# Altium project Jetson_Xavier_NX_Carrier_Board_v1.1.PrjPcb
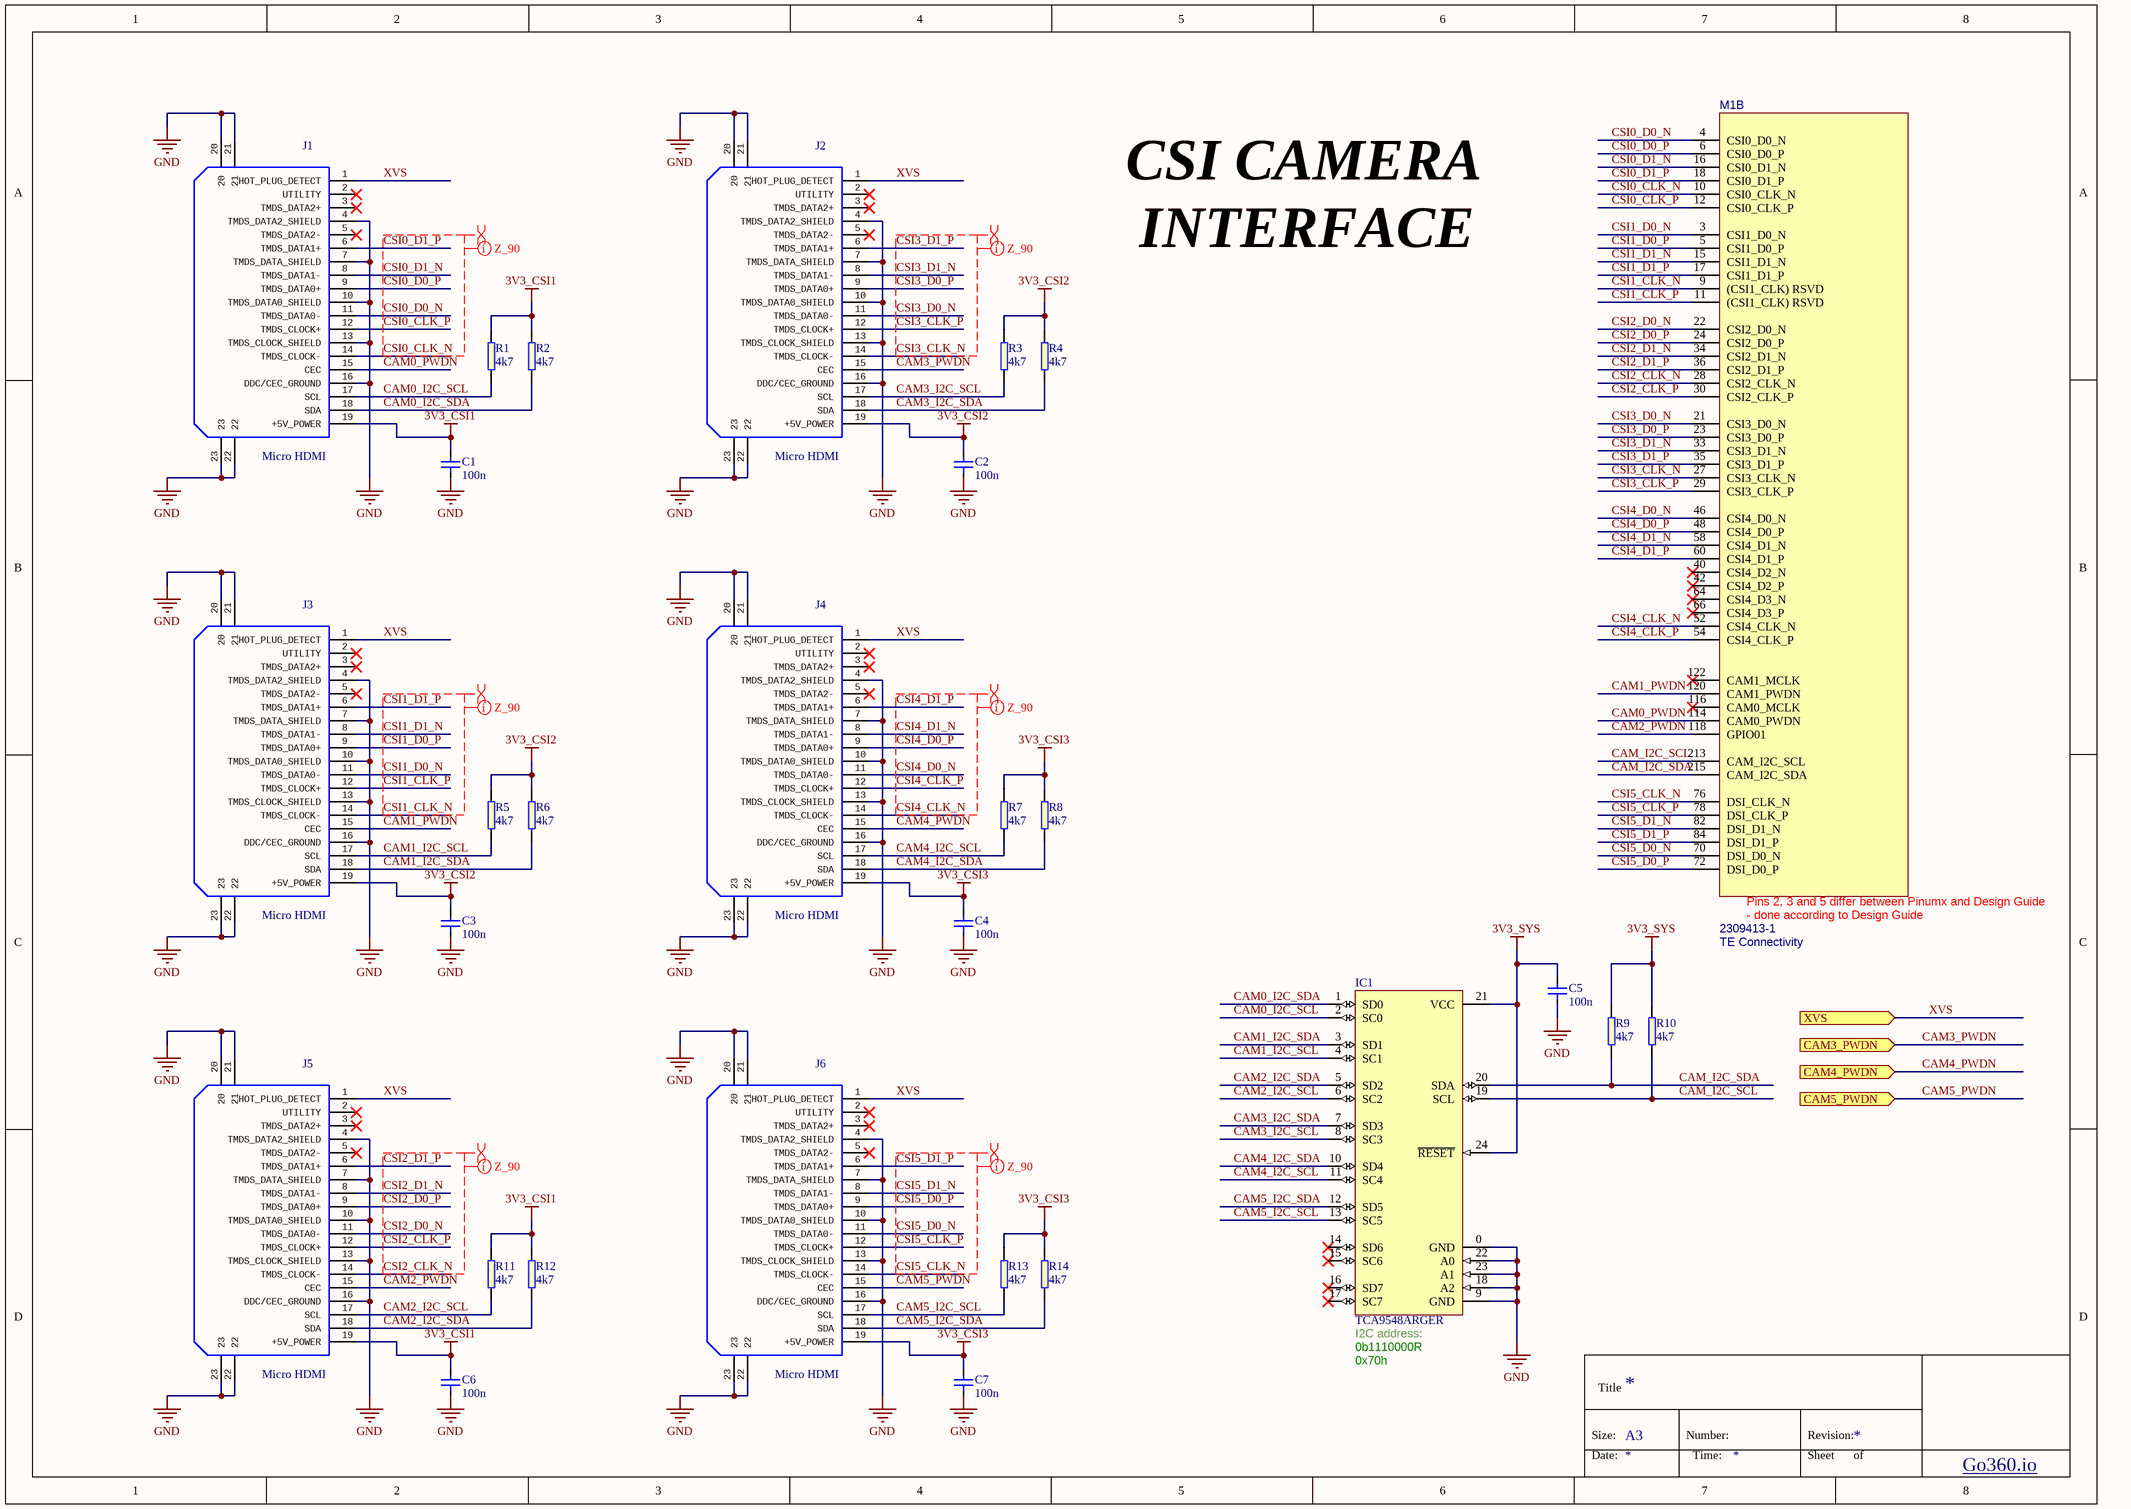
[diagram p0: CSI.SchDoc]
7 sheets, 262 parts. Net scope: flat (ports and power ports of the same name join across sheets).
Board file: Xavier_NX_Carrier_Board_v1.1.PcbDoc
Sheets:
  CSI.SchDoc
  Display.SchDoc
  ETHERNET.SchDoc
  NVME.SchDoc
  POWER.SchDoc
  USB.SchDoc
  WIFI_BT.SchDoc

## Sheet CSI.SchDoc
size A3

### Parts
(Parts that share a designator on the sheet are numbered #1, #2 ... from top to bottom, then left to right.)
C1  100n  [C0402]
C2  100n  [C0402]
C3  100n  [C0402]
C4  100n  [C0402]
C5  100n  [C0402]
C6  100n  [C0402]
C7  100n  [C0402]
IC1  TCA9548ARGER  [VQFN-24]
J1  Micro HDMI  [HDMI-0467650301]
J2  Micro HDMI  [HDMI-0467650301]
J3  Micro HDMI  [HDMI-0467650301]
J4  Micro HDMI  [HDMI-0467650301]
J5  Micro HDMI  [HDMI-0467650301]
J6  Micro HDMI  [HDMI-0467650301]
M1#1  Manufacturer: TE Connectivity  [jetson-nano-connector]  (hidden comment: 2309413-1)  (part B of 7)
R1  4k7  [R0402]
R2  4k7  [R0402]
R3  4k7  [R0402]
R4  4k7  [R0402]
R5  4k7  [R0402]
R6  4k7  [R0402]
R7  4k7  [R0402]
R8  4k7  [R0402]
R9  4k7  [R0402]
R10  4k7  [R0402]
R11  4k7  [R0402]
R12  4k7  [R0402]
R13  4k7  [R0402]
R14  4k7  [R0402]

### Ports
CAM3_PWDN (in), CAM4_PWDN (in), CAM5_PWDN (in), XVS (in)

### Nets
3V3_CSI1: C1.2 C6.2 J1.19(+5V_POWER) J5.19(+5V_POWER) R1.2 R2.2 R11.2 R12.2
3V3_CSI2: C2.2 C3.2 J2.19(+5V_POWER) J3.19(+5V_POWER) R3.2 R4.2 R5.2 R6.2
3V3_CSI3: C4.2 C7.2 J4.19(+5V_POWER) J6.19(+5V_POWER) R7.2 R8.2 R13.2 R14.2
3V3_SYS: C5.2 IC1.21(VCC) IC1.24(~{RESET}) R9.2 R10.2
GND: C1.1 C2.1 C3.1 C4.1 C5.1 C6.1 C7.1 IC1.0(GND) IC1.9(GND) IC1.18(A2) IC1.22(A0) IC1.23(A1) J1.4(TMDS_DATA2_SHIELD) J1.7(TMDS_DATA_SHIELD) J1.10(TMDS_DATA0_SHIELD) J1.13(TMDS_CLOCK_SHIELD) J1.16(DDC/CEC_GROUND) J1.20 J1.21 J1.22 J1.23 J2.4(TMDS_DATA2_SHIELD) J2.7(TMDS_DATA_SHIELD) J2.10(TMDS_DATA0_SHIELD) J2.13(TMDS_CLOCK_SHIELD) J2.16(DDC/CEC_GROUND) J2.20 J2.21 J2.22 J2.23 J3.4(TMDS_DATA2_SHIELD) J3.7(TMDS_DATA_SHIELD) J3.10(TMDS_DATA0_SHIELD) J3.13(TMDS_CLOCK_SHIELD) J3.16(DDC/CEC_GROUND) J3.20 J3.21 J3.22 J3.23 J4.4(TMDS_DATA2_SHIELD) J4.7(TMDS_DATA_SHIELD) J4.10(TMDS_DATA0_SHIELD) J4.13(TMDS_CLOCK_SHIELD) J4.16(DDC/CEC_GROUND) J4.20 J4.21 J4.22 J4.23 J5.4(TMDS_DATA2_SHIELD) J5.7(TMDS_DATA_SHIELD) J5.10(TMDS_DATA0_SHIELD) J5.13(TMDS_CLOCK_SHIELD) J5.16(DDC/CEC_GROUND) J5.20 J5.21 J5.22 J5.23 J6.4(TMDS_DATA2_SHIELD) J6.7(TMDS_DATA_SHIELD) J6.10(TMDS_DATA0_SHIELD) J6.13(TMDS_CLOCK_SHIELD) J6.16(DDC/CEC_GROUND) J6.20 J6.21 J6.22 J6.23
CAM0_I2C_SCL: IC1.2(SC0) J1.17(SCL) R1.1
CAM0_I2C_SDA: IC1.1(SD0) J1.18(SDA) R2.1
CAM0_PWDN: J1.15(CEC) M1#1.114(CAM0_PWDN)
CAM1_I2C_SCL: IC1.4(SC1) J3.17(SCL) R5.1
CAM1_I2C_SDA: IC1.3(SD1) J3.18(SDA) R6.1
CAM1_PWDN: J3.15(CEC) M1#1.120(CAM1_PWDN)
CAM2_I2C_SCL: IC1.6(SC2) J5.17(SCL) R11.1
CAM2_I2C_SDA: IC1.5(SD2) J5.18(SDA) R12.1
CAM2_PWDN: J5.15(CEC) M1#1.118(GPIO01)
CAM3_I2C_SCL: IC1.8(SC3) J2.17(SCL) R3.1
CAM3_I2C_SDA: IC1.7(SD3) J2.18(SDA) R4.1
CAM3_PWDN: J2.15(CEC) ; port CAM3_PWDN
CAM4_I2C_SCL: IC1.11(SC4) J4.17(SCL) R7.1
CAM4_I2C_SDA: IC1.10(SD4) J4.18(SDA) R8.1
CAM4_PWDN: J4.15(CEC) ; port CAM4_PWDN
CAM5_I2C_SCL: IC1.13(SC5) J6.17(SCL) R13.1
CAM5_I2C_SDA: IC1.12(SD5) J6.18(SDA) R14.1
CAM5_PWDN: J6.15(CEC) ; port CAM5_PWDN
CAM_I2C_SCL: IC1.19(SCL) M1#1.213(CAM_I2C_SCL) R10.1
CAM_I2C_SDA: IC1.20(SDA) M1#1.215(CAM_I2C_SDA) R9.1
CSI0_CLK_N: J1.14(TMDS_CLOCK-) M1#1.10(CSI0_CLK_N)
CSI0_CLK_P: J1.12(TMDS_CLOCK+) M1#1.12(CSI0_CLK_P)
CSI0_D0_N: J1.11(TMDS_DATA0-) M1#1.4(CSI0_D0_N)
CSI0_D0_P: J1.9(TMDS_DATA0+) M1#1.6(CSI0_D0_P)
CSI0_D1_N: J1.8(TMDS_DATA1-) M1#1.16(CSI0_D1_N)
CSI0_D1_P: J1.6(TMDS_DATA1+) M1#1.18(CSI0_D1_P)
CSI1_CLK_N: J3.14(TMDS_CLOCK-) M1#1.9((CSI1_CLK)_RSVD)
CSI1_CLK_P: J3.12(TMDS_CLOCK+) M1#1.11((CSI1_CLK)_RSVD)
CSI1_D0_N: J3.11(TMDS_DATA0-) M1#1.3(CSI1_D0_N)
CSI1_D0_P: J3.9(TMDS_DATA0+) M1#1.5(CSI1_D0_P)
CSI1_D1_N: J3.8(TMDS_DATA1-) M1#1.15(CSI1_D1_N)
CSI1_D1_P: J3.6(TMDS_DATA1+) M1#1.17(CSI1_D1_P)
CSI2_CLK_N: J5.14(TMDS_CLOCK-) M1#1.28(CSI2_CLK_N)
CSI2_CLK_P: J5.12(TMDS_CLOCK+) M1#1.30(CSI2_CLK_P)
CSI2_D0_N: J5.11(TMDS_DATA0-) M1#1.22(CSI2_D0_N)
CSI2_D0_P: J5.9(TMDS_DATA0+) M1#1.24(CSI2_D0_P)
CSI2_D1_N: J5.8(TMDS_DATA1-) M1#1.34(CSI2_D1_N)
CSI2_D1_P: J5.6(TMDS_DATA1+) M1#1.36(CSI2_D1_P)
CSI3_CLK_N: J2.14(TMDS_CLOCK-) M1#1.27(CSI3_CLK_N)
CSI3_CLK_P: J2.12(TMDS_CLOCK+) M1#1.29(CSI3_CLK_P)
CSI3_D0_N: J2.11(TMDS_DATA0-) M1#1.21(CSI3_D0_N)
CSI3_D0_P: J2.9(TMDS_DATA0+) M1#1.23(CSI3_D0_P)
CSI3_D1_N: J2.8(TMDS_DATA1-) M1#1.33(CSI3_D1_N)
CSI3_D1_P: J2.6(TMDS_DATA1+) M1#1.35(CSI3_D1_P)
CSI4_CLK_N: J4.14(TMDS_CLOCK-) M1#1.52(CSI4_CLK_N)
CSI4_CLK_P: J4.12(TMDS_CLOCK+) M1#1.54(CSI4_CLK_P)
CSI4_D0_N: J4.11(TMDS_DATA0-) M1#1.46(CSI4_D0_N)
CSI4_D0_P: J4.9(TMDS_DATA0+) M1#1.48(CSI4_D0_P)
CSI4_D1_N: J4.8(TMDS_DATA1-) M1#1.58(CSI4_D1_N)
CSI4_D1_P: J4.6(TMDS_DATA1+) M1#1.60(CSI4_D1_P)
CSI5_CLK_N: J6.14(TMDS_CLOCK-) M1#1.76(DSI_CLK_N)
CSI5_CLK_P: J6.12(TMDS_CLOCK+) M1#1.78(DSI_CLK_P)
CSI5_D0_N: J6.11(TMDS_DATA0-) M1#1.70(DSI_D0_N)
CSI5_D0_P: J6.9(TMDS_DATA0+) M1#1.72(DSI_D0_P)
CSI5_D1_N: J6.8(TMDS_DATA1-) M1#1.82(DSI_D1_N)
CSI5_D1_P: J6.6(TMDS_DATA1+) M1#1.84(DSI_D1_P)
XVS: J1.1(HOT_PLUG_DETECT) J2.1(HOT_PLUG_DETECT) J3.1(HOT_PLUG_DETECT) J4.1(HOT_PLUG_DETECT) J5.1(HOT_PLUG_DETECT) J6.1(HOT_PLUG_DETECT) ; port XVS

Not connected (* = marked no-connect by the designer): IC1 14(SD6)* 15(SC6)* 16(SD7)* 17(SC7)*; J1 2(UTILITY)* 3(TMDS_DATA2+)* 5(TMDS_DATA2-)*; J2 2(UTILITY)* 3(TMDS_DATA2+)* 5(TMDS_DATA2-)*; J3 2(UTILITY)* 3(TMDS_DATA2+)* 5(TMDS_DATA2-)*; J4 2(UTILITY)* 3(TMDS_DATA2+)* 5(TMDS_DATA2-)*; J5 2(UTILITY)* 3(TMDS_DATA2+)* 5(TMDS_DATA2-)*; J6 2(UTILITY)* 3(TMDS_DATA2+)* 5(TMDS_DATA2-)*; M1#1 40(CSI4_D2_N)* 42(CSI4_D2_P)* 64(CSI4_D3_N)* 66(CSI4_D3_P)* 116(CAM0_MCLK)* 122(CAM1_MCLK)*

### Layout directives
differential pair: CSI0_CLK_N, CSI0_CLK_P, CSI0_D0_N, CSI0_D0_P, CSI0_D1_N, CSI0_D1_P, CSI1_CLK_N, CSI1_CLK_P, CSI1_D0_N, CSI1_D0_P, CSI1_D1_N, CSI1_D1_P, CSI2_CLK_N, CSI2_CLK_P, CSI2_D0_N, CSI2_D0_P, CSI2_D1_N, CSI2_D1_P, CSI3_CLK_N, CSI3_CLK_P, CSI3_D0_N, CSI3_D0_P, CSI3_D1_N, CSI3_D1_P, CSI4_CLK_N, CSI4_CLK_P, CSI4_D0_N, CSI4_D0_P, CSI4_D1_N, CSI4_D1_P, CSI5_CLK_N, CSI5_CLK_P, CSI5_D0_N, CSI5_D0_P, CSI5_D1_N, CSI5_D1_P
net class Z_95: CSI0_CLK_N, CSI0_CLK_P, CSI0_D0_N, CSI0_D0_P, CSI0_D1_N, CSI0_D1_P, CSI1_CLK_N, CSI1_CLK_P, CSI1_D0_N, CSI1_D0_P, CSI1_D1_N, CSI1_D1_P, CSI2_CLK_N, CSI2_CLK_P, CSI2_D0_N, CSI2_D0_P, CSI2_D1_N, CSI2_D1_P, CSI3_CLK_N, CSI3_CLK_P, CSI3_D0_N, CSI3_D0_P, CSI3_D1_N, CSI3_D1_P, CSI4_CLK_N, CSI4_CLK_P, CSI4_D0_N, CSI4_D0_P, CSI4_D1_N, CSI4_D1_P, CSI5_CLK_N, CSI5_CLK_P, CSI5_D0_N, CSI5_D0_P, CSI5_D1_N, CSI5_D1_P

### Notes on the sheet
- CSI CAMERA
- INTERFACE
- 0x70h
- (near IC1) 0b1110000R
- (near IC1) I2C address:
- Title
- Size:
- Date:
- A3
- Number:
- Time:
- Revision:
- Sheet
- of
- Go360.io
- (in symbol jetson-nano-new-release, part B) Pins 2, 3 and 5 differ between Pinumx and Design Guide; - done according to Design Guide

### Library data of the parts
C1-C7 = C_100n_0402: MLCC SMT Capacitor 100n 0402; Manufacturer: TDK; PartSymbol: C1005X5R0J104K050BA; PartNumber: C_100n_0402; Value: 100n
IC1 = TCA9548A: TCA9548ARGER  I2C SWITCH W/ RESET, 8-CH, VQFN-24; Manufacturer: TEXAS INSTRUMENTS; Value: TCA9548ARGER; PartNumber: TCA9548ARGER; PartSymbol: TCA9548ARGER
J1-J6 = HDMI-0467650301
M1#1 = jetson-nano-new-release: PartNumber: 2309413-1; PartSymbol: 2309413-1; Value: 2309413-1
R1-R14 = R_4k7_0402: RES, 4k7, 0402; Manufacturer: Panasonic; PartSymbol: ERJ2GEJ472X; PartNumber: R_4k7_0402; Value: 4k7

## Sheet Display.SchDoc
size A3
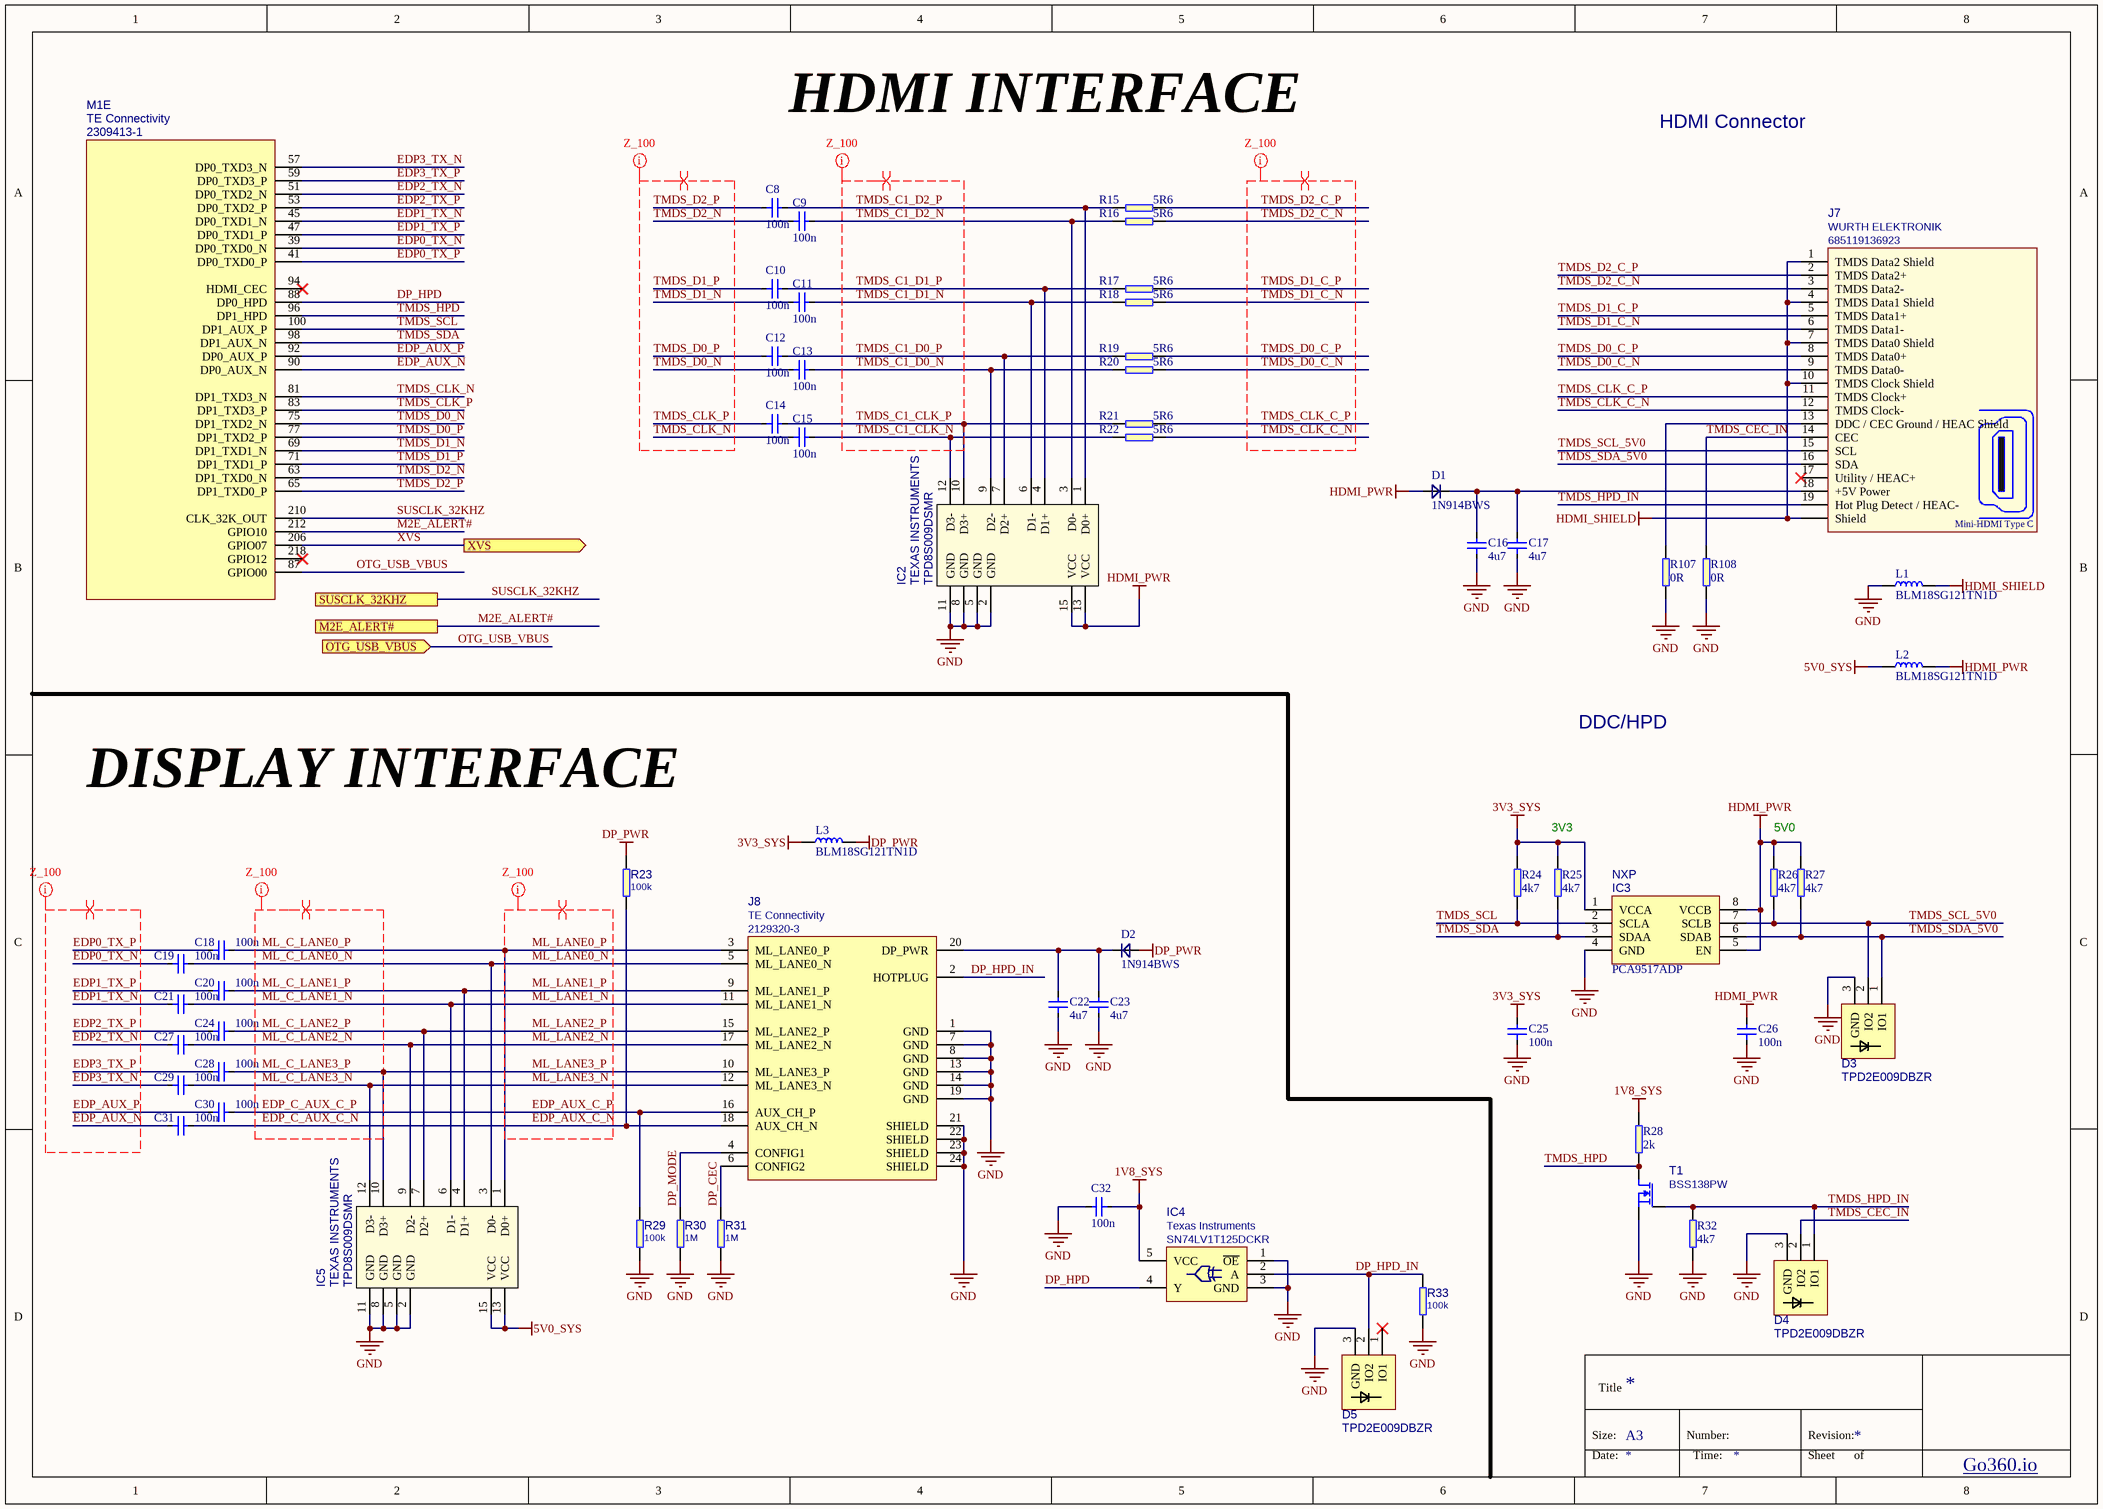
[diagram p1: Display.SchDoc]

### Parts
(Parts that share a designator on the sheet are numbered #1, #2 ... from top to bottom, then left to right.)
C8  100n  [C0402]
C9  100n  [C0402]
C10  100n  [C0402]
C11  100n  [C0402]
C12  100n  [C0402]
C13  100n  [C0402]
C14  100n  [C0402]
C15  100n  [C0402]
C16  4u7  [C0402]
C17  4u7  [C0402]
C18  100n  [C0402]
C19  100n  [C0402]
C20  100n  [C0402]
C21  100n  [C0402]
C22  4u7  [C0402]
C23  4u7  [C0402]
C24  100n  [C0402]
C25  100n  [C0402]
C26  100n  [C0402]
C27  100n  [C0402]
C28  100n  [C0402]
C29  100n  [C0402]
C30  100n  [C0402]
C31  100n  [C0402]
C32  100n  [C0402]
D1  1N914BWS  [SOD-323]
D2  1N914BWS  [SOD-323]
D3  TPD2E009DBZR  [SOT-23s]
D4  TPD2E009DBZR  [SOT-23s]
D5  TPD2E009DBZR  [SOT-23s]
IC2  Manufacturer: TEXAS INSTRUMENTS  PartSymbol: TPD8S009DSMR  [SON-15]  (hidden comment: TPD8S009)
IC3  PCA9517ADP  [MSOP-8]
IC4  SN74LV1T125DCKR  Manufacturer: Texas Instruments  [SC70-5]
IC5  Manufacturer: TEXAS INSTRUMENTS  PartSymbol: TPD8S009DSMR  [SON-15]  (hidden comment: TPD8S009)
J7  685119136923  Manufacturer: WURTH ELEKTRONIK  [WE_685119136923]
J8  2129320-3  Manufacturer: TE Connectivity  [2129320-3]
L1  BLM18SG121TN1D  [BEADC1608X65N]
L2  BLM18SG121TN1D  [BEADC1608X65N]
L3  BLM18SG121TN1D  [BEADC1608X65N]
M1#2  Manufacturer: TE Connectivity  [jetson-nano-connector]  (hidden comment: 2309413-1)  (part E of 7)
R15  5R6  [R0402]
R16  5R6  [R0402]
R17  5R6  [R0402]
R18  5R6  [R0402]
R19  5R6  [R0402]
R20  5R6  [R0402]
R21  5R6  [R0402]
R22  5R6  [R0402]
R23  100k  [R0402]
R24  4k7  [R0402]
R25  4k7  [R0402]
R26  4k7  [R0402]
R27  4k7  [R0402]
R28  2k  [R0402]
R29  100k  [R0402]
R30  1M  [R0402]
R31  1M  [R0402]
R32  4k7  [R0402]
R33  100k  [R0402]
R107  0R  [R0402]
R108  0R  [R0402]
T1  BSS138PW  [SC70-3]

### Ports
M2E_ALERT#, OTG_USB_VBUS (in), SUSCLK_32KHZ, XVS (out)

### Nets
1V8_SYS: C32.1 IC4.5(VCC) R28.2
3V3_SYS: C25.2 IC3.1(VCCA) L3.1 R24.2 R25.2
5V0_SYS: IC5.13(VCC) IC5.15(VCC) L2.1
DP_PWR: D2.A L3.2 R23.1
GND: C16.1 C17.1 C22.1 C23.1 C25.1 C26.1 C32.2 D3.3(GND) D4.3(GND) D5.3(GND) IC2.2(GND) IC2.5(GND) IC2.8(GND) IC2.11(GND) IC3.4(GND) IC4.1(~{OE}) IC4.3(GND) IC5.2(GND) IC5.5(GND) IC5.8(GND) IC5.11(GND) J8.1(GND) J8.7(GND) J8.8(GND) J8.13(GND) J8.14(GND) J8.19(GND) J8.21(SHIELD) J8.22(SHIELD) J8.23(SHIELD) J8.24(SHIELD) L1.1 R29.2 R30.2 R31.2 R32.1 R33.2 R107.1 R108.1 T1.2(S)
HDMI_PWR: C26.2 D1.A IC2.13(VCC) IC2.15(VCC) IC3.5(EN) IC3.8(VCCB) L2.2 R26.2 R27.2
HDMI_SHIELD: J7.1(TMDS_Data2_Shield) J7.4(TMDS_Data1_Shield) J7.7(TMDS_Data0_Shield) J7.10(TMDS_Clock_Shield) J7.Shell(Shield) L1.2
DP_CEC: J8.6(CONFIG2) R31.1
DP_HPD: IC4.4(Y) M1#2.88(DP0_HPD)
DP_HPD_IN: D5.2(IO2) IC4.2(A) J8.2(HOTPLUG) R33.1
DP_MODE: J8.4(CONFIG1) R30.1
EDP0_TX_N: C19.1 M1#2.39(DP0_TXD0_N)
EDP0_TX_P: C18.1 M1#2.41(DP0_TXD0_P)
EDP1_TX_N: C21.1 M1#2.45(DP0_TXD1_N)
EDP1_TX_P: C20.1 M1#2.47(DP0_TXD1_P)
EDP2_TX_N: C27.1 M1#2.51(DP0_TXD2_N)
EDP2_TX_P: C24.1 M1#2.53(DP0_TXD2_P)
EDP3_TX_N: C29.1 M1#2.57(DP0_TXD3_N)
EDP3_TX_P: C28.1 M1#2.59(DP0_TXD3_P)
EDP_AUX_C_N: C31.2 J8.18(AUX_CH_N) R23.2  [also labelled EDP_C_AUX_C_N]
EDP_AUX_C_P: C30.2 J8.16(AUX_CH_P) R29.1  [also labelled EDP_C_AUX_C_P]
EDP_AUX_N: C31.1 M1#2.90(DP0_AUX_N)
EDP_AUX_P: C30.1 M1#2.92(DP0_AUX_P)
M2E_ALERT#: M1#2.212(GPIO10) ; port M2E_ALERT#
ML_C_LANE0_N: C19.2 IC5.3(D0-) J8.5(ML_LANE0_N)  [also labelled ML_LANE0_N]
ML_C_LANE0_P: C18.2 IC5.1(D0+) J8.3(ML_LANE0_P)  [also labelled ML_LANE0_P]
ML_C_LANE1_N: C21.2 IC5.6(D1-) J8.11(ML_LANE1_N)  [also labelled ML_LANE1_N]
ML_C_LANE1_P: C20.2 IC5.4(D1+) J8.9(ML_LANE1_P)  [also labelled ML_LANE1_P]
ML_C_LANE2_N: C27.2 IC5.9(D2-) J8.17(ML_LANE2_N)  [also labelled ML_LANE2_N]
ML_C_LANE2_P: C24.2 IC5.7(D2+) J8.15(ML_LANE2_P)  [also labelled ML_LANE2_P]
ML_C_LANE3_N: C29.2 IC5.12(D3-) J8.12(ML_LANE3_N)  [also labelled ML_LANE3_N]
ML_C_LANE3_P: C28.2 IC5.10(D3+) J8.10(ML_LANE3_P)  [also labelled ML_LANE3_P]
OTG_USB_VBUS: M1#2.87(GPIO00) ; port OTG_USB_VBUS
SUSCLK_32KHZ: M1#2.210(CLK_32K_OUT) ; port SUSCLK_32KHZ
TMDS_C1_CLK_N: C15.2 IC2.12(D3-) R22.1
TMDS_C1_CLK_P: C14.2 IC2.10(D3+) R21.1
TMDS_C1_D0_N: C13.2 IC2.9(D2-) R20.1
TMDS_C1_D0_P: C12.2 IC2.7(D2+) R19.1
TMDS_C1_D1_N: C11.2 IC2.6(D1-) R18.1
TMDS_C1_D1_P: C10.2 IC2.4(D1+) R17.1
TMDS_C1_D2_N: C9.2 IC2.3(D0-) R16.1
TMDS_C1_D2_P: C8.2 IC2.1(D0+) R15.1
TMDS_CEC_IN: D4.2(IO2) J7.14(CEC) R108.2
TMDS_CLK_C_N: J7.12(TMDS_Clock-) R22.2
TMDS_CLK_C_P: J7.11(TMDS_Clock+) R21.2
TMDS_CLK_N: C15.1 M1#2.81(DP1_TXD3_N)
TMDS_CLK_P: C14.1 M1#2.83(DP1_TXD3_P)
TMDS_D0_C_N: J7.9(TMDS_Data0-) R20.2
TMDS_D0_C_P: J7.8(TMDS_Data0+) R19.2
TMDS_D0_N: C13.1 M1#2.75(DP1_TXD2_N)
TMDS_D0_P: C12.1 M1#2.77(DP1_TXD2_P)
TMDS_D1_C_N: J7.6(TMDS_Data1-) R18.2
TMDS_D1_C_P: J7.5(TMDS_Data1+) R17.2
TMDS_D1_N: C11.1 M1#2.69(DP1_TXD1_N)
TMDS_D1_P: C10.1 M1#2.71(DP1_TXD1_P)
TMDS_D2_C_N: J7.3(TMDS_Data2-) R16.2
TMDS_D2_C_P: J7.2(TMDS_Data2+) R15.2
TMDS_D2_N: C9.1 M1#2.63(DP1_TXD0_N)
TMDS_D2_P: C8.1 M1#2.65(DP1_TXD0_P)
TMDS_HPD: M1#2.96(DP1_HPD) R28.1 T1.3(D)
TMDS_HPD_IN: D4.1(IO1) J7.19(Hot_Plug_Detect_/_HEAC-) R32.2 T1.1(G)
TMDS_SCL: IC3.2(SCLA) M1#2.100(DP1_AUX_P) R24.1
TMDS_SCL_5V0: D3.2(IO2) IC3.7(SCLB) J7.15(SCL) R26.1
TMDS_SDA: IC3.3(SDAA) M1#2.98(DP1_AUX_N) R25.1
TMDS_SDA_5V0: D3.1(IO1) IC3.6(SDAB) J7.16(SDA) R27.1
XVS: M1#2.206(GPIO07) ; port XVS
NetC16_2: C16.2 C17.2 D1.C J7.18(+5V_Power)
NetC22_2: C22.2 C23.2 D2.C J8.20(DP_PWR)
NetJ7_13: J7.13(DDC_/_CEC_Ground_/_HEAC_Shield) R107.2

Not connected (* = marked no-connect by the designer): D5 1(IO1)*; J7 17(Utility_/_HEAC+)*; M1#2 94(HDMI_CEC)* 218(GPIO12)*

### Layout directives
differential pair: EDP0_TX_N, EDP0_TX_P, EDP1_TX_N, EDP1_TX_P, EDP2_TX_N, EDP2_TX_P, EDP3_TX_N, EDP3_TX_P, EDP_AUX_C_N, EDP_AUX_C_P, EDP_AUX_N, EDP_AUX_P, EDP_C_AUX_C_N, EDP_C_AUX_C_P, ML_C_LANE0_N, ML_C_LANE0_P, ML_C_LANE1_N, ML_C_LANE1_P, ML_C_LANE2_N, ML_C_LANE2_P, ML_C_LANE3_N, ML_C_LANE3_P, ML_LANE0_N, ML_LANE0_P, ML_LANE1_N, ML_LANE1_P, ML_LANE2_N, ML_LANE2_P, ML_LANE3_N, ML_LANE3_P, TMDS_C1_CLK_N, TMDS_C1_CLK_P, TMDS_C1_D0_N, TMDS_C1_D0_P, TMDS_C1_D1_N, TMDS_C1_D1_P, TMDS_C1_D2_N, TMDS_C1_D2_P, TMDS_CLK_C_N, TMDS_CLK_C_P, TMDS_CLK_N, TMDS_CLK_P, TMDS_D0_C_N, TMDS_D0_C_P, TMDS_D0_N, TMDS_D0_P, TMDS_D1_C_N, TMDS_D1_C_P, TMDS_D1_N, TMDS_D1_P, TMDS_D2_C_N, TMDS_D2_C_P, TMDS_D2_N, TMDS_D2_P
net class Z_100: EDP0_TX_N, EDP0_TX_P, EDP1_TX_N, EDP1_TX_P, EDP2_TX_N, EDP2_TX_P, EDP3_TX_N, EDP3_TX_P, EDP_AUX_C_N, EDP_AUX_C_P, EDP_AUX_N, EDP_AUX_P, EDP_C_AUX_C_N, EDP_C_AUX_C_P, ML_C_LANE0_N, ML_C_LANE0_P, ML_C_LANE1_N, ML_C_LANE1_P, ML_C_LANE2_N, ML_C_LANE2_P, ML_C_LANE3_N, ML_C_LANE3_P, ML_LANE0_N, ML_LANE0_P, ML_LANE1_N, ML_LANE1_P, ML_LANE2_N, ML_LANE2_P, ML_LANE3_N, ML_LANE3_P, TMDS_C1_CLK_N, TMDS_C1_CLK_P, TMDS_C1_D0_N, TMDS_C1_D0_P, TMDS_C1_D1_N, TMDS_C1_D1_P, TMDS_C1_D2_N, TMDS_C1_D2_P, TMDS_CLK_C_N, TMDS_CLK_C_P, TMDS_CLK_N, TMDS_CLK_P, TMDS_D0_C_N, TMDS_D0_C_P, TMDS_D0_N, TMDS_D0_P, TMDS_D1_C_N, TMDS_D1_C_P, TMDS_D1_N, TMDS_D1_P, TMDS_D2_C_N, TMDS_D2_C_P, TMDS_D2_N, TMDS_D2_P

### Notes on the sheet
- HDMI INTERFACE
- HDMI Connector
- DDC/HPD
- DISPLAY INTERFACE
- 3V3
- 5V0
- (near IC3) NXP
- Title
- Size:
- Date:
- A3
- Number:
- Time:
- Revision:
- Sheet
- of
- Go360.io
- (in symbol WE_685119136923) Mini-HDMI Type C

### Library data of the parts
C8-C15 C18-C21 C24-C32 = C_100n_0402: as C1 on sheet CSI; PartNumber: C_100n_0402; Value: 100n
C16 C17 C22 C23 = C_4u7_0402: MLCC SMT Capacitor 4.7uF 0402; Manufacturer: MURATA; PartSymbol: GRM155R60G475ME; PartNumber: C_4u7_0402; Value: 4u7
D1 D2 = diode: Diode small signal; Manufacturer: ON SEMICONDUCTOR; Value: 1N914BWS; PartNumber: 1N914BWS; PartSymbol: 1N914BWS
D3-D5 = TPD2E009DBZR: DIODE, SCHOTTKY, 30V, 200MA, SOT-23; Manufacturer: NXP; PartNumber: TPD2E009DBZR; Value: TPD2E009DBZR; MPN: TPD2E009DBZR
IC2 IC5 = TPD8S009: 8-Channel ESD Protection for DisplayPort and HDMI; Value: TPD8S009; PartNumber: TPD8S009
IC3 = PCA9517ADP: IC REDRIVER I2C 1CH 8TSSOP; Manufacturer: NXP; Value: PCA9517ADP; PartNumber: PCA9517ADP; PartSymbol: PCA9517ADP
IC4 = SN74LV1T125: Buffer, 74LV1T125, 1.6 V to 5.5 V, SOT-23-5; PartNumber: SN74LV1T125DCKR; Value: SN74LV1T125DCKR; PartSymbol: SN74LV1T125DCKR
J7 = WE_685119136923: CONN HDMI FEMALE R/A 19POS 2.6MM; PartNumber: WE_685119136923; Value: 685119136923; PartSymbol: WE_685119136923
J8 = miniDP: Mini Displayport Reverse Offset; PartNumber: 2129320-3; Value: 2129320-3; PartSymbol: 2129320-3
L1-L3 = BLM18SG121TN1D: FERRITE BEAD, 0.025OHM, 3A, 0603; Manufacturer: MURATA; PartNumber: BLM18SG121TN1D; Value: BLM18SG121TN1D; PartSymbol: BLM18SG121TN1D
M1#2 = jetson-nano-new-release: PartNumber: 2309413-1; PartSymbol: 2309413-1; Value: 2309413-1
R15-R22 = R_5R6_0402: RES, 5R6, 0402; Manufacturer: Panasonic; PartSymbol: ERJ2GEJ5R6X; PartNumber: R_5R6_0402; Value: 5R6
R23 R29 R33 = R_100k_0402: SMT Resistor 100k 0402; Manufacturer: VISHAY; PartSymbol: CRCW0402100KFKEDHP; Tolerance: 1%; PartNumber: R_100k_0402; Value: 100k
R24-R27 R32 = R_4k7_0402: as R1 on sheet CSI; PartNumber: R_4k7_0402; Value: 4k7
R28 = R_2k_0402: RES, 2k, 0402; Manufacturer: VISHAY; PartSymbol: CRCW04022K00FKED; PartNumber: R_2k_0402; Value: 2k
R30 R31 = R_1M_0402: SMT Resistor 1M 0402; Manufacturer: VISHAY; PartSymbol: CRCW04021M00FKED; Tolerance: 1%; PartNumber: R_1M_0402; Value: 1M
R107 R108 = R_0R_0402: RES, 0R, 0402; Manufacturer: Panasonic; PartSymbol: ERJ2GE0R00X; PartNumber: R_0R_0402; Value: 0R
T1 = NMOS: MOSFET, N CH, 60V, 0.2A; Manufacturer: NXP; Value: BSS138PW; PartNumber: BSS138PW; PartSymbol: BSS138PW

## Sheet ETHERNET.SchDoc
size A3
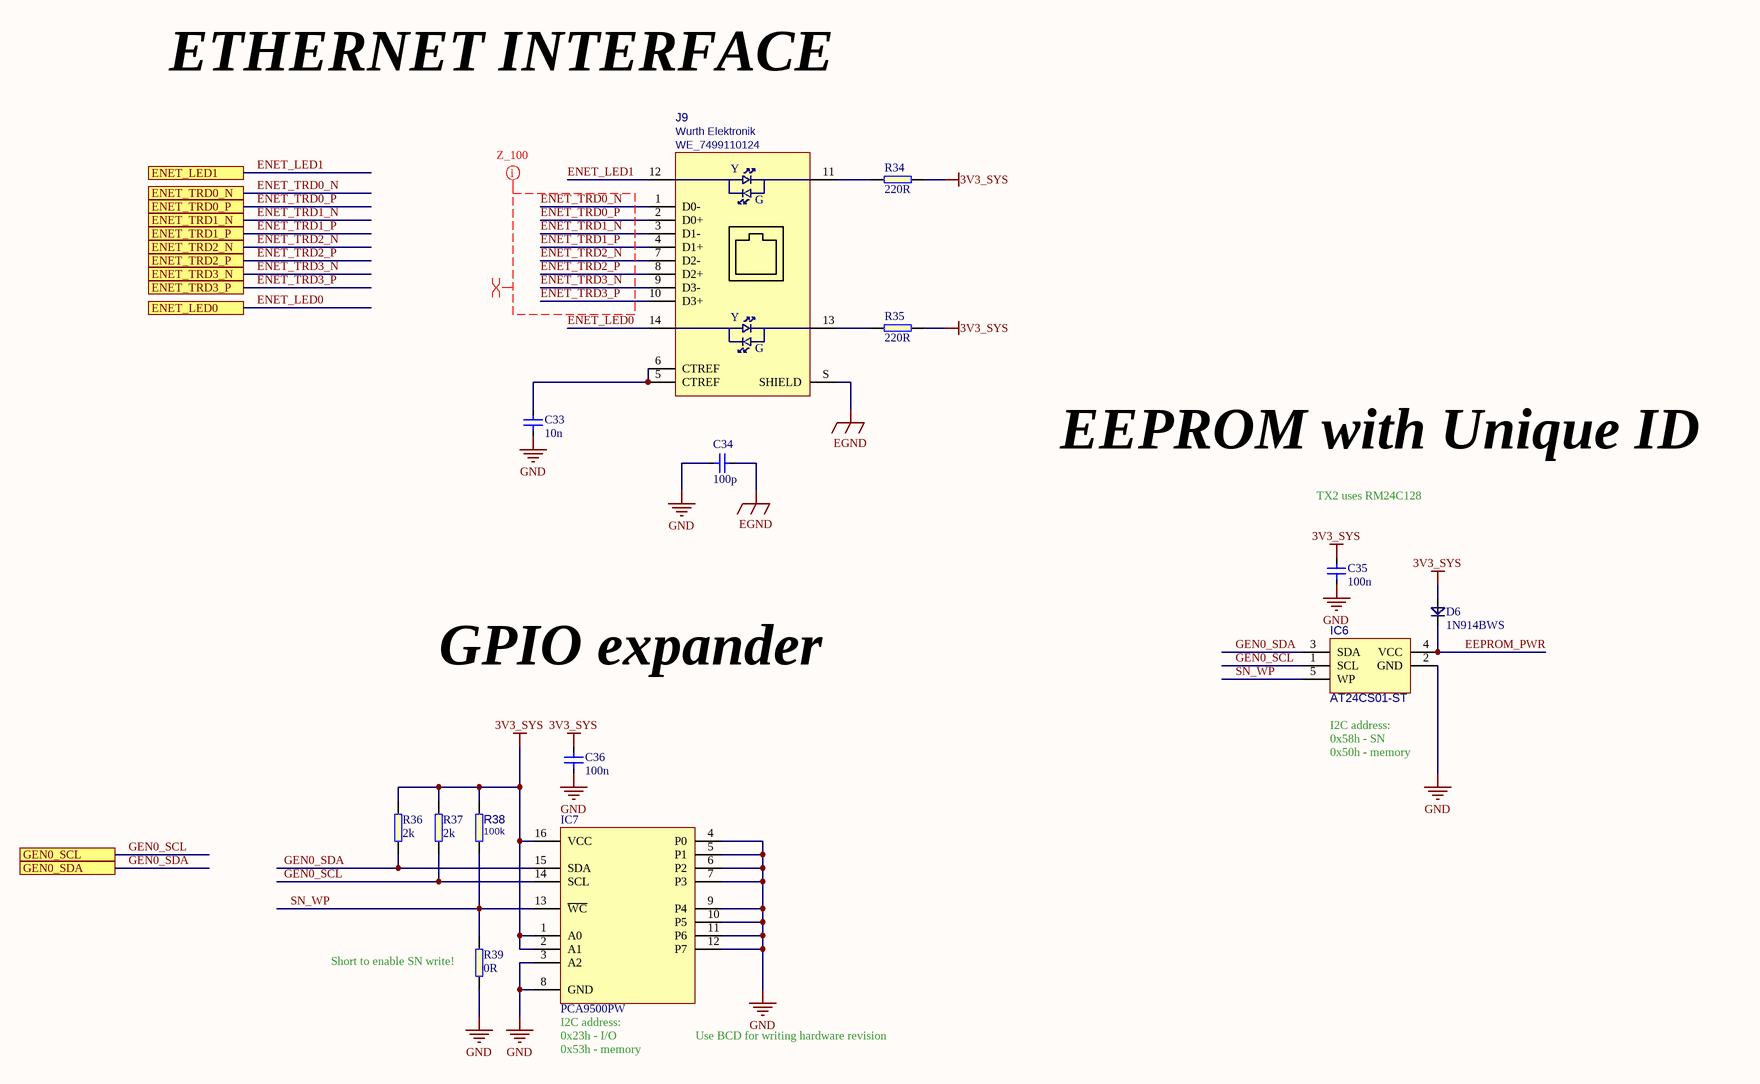
[diagram p2: ETHERNET.SchDoc]

### Parts
C33  10n  [C0402]
C34  100p  [0805]
C35  100n  [C0402]
C36  100n  [C0402]
D6  1N914BWS  [SOD-323]
IC6  AT24CS01-ST  [SOT23-5]
IC7  PCA9500PW  [TSSOP-16]
J9  Manufacturer: Wurth Elektronik  [WE_7499110124]  (hidden comment: WE_7499110124)
R34  220R  [R0402]
R35  220R  [R0402]
R36  2k  [R0402]
R37  2k  [R0402]
R38  100k  [R0402]
R39  0R  [R0402]

### Ports
ENET_LED0, ENET_LED1, ENET_TRD0_N, ENET_TRD0_P, ENET_TRD1_N, ENET_TRD1_P, ENET_TRD2_N, ENET_TRD2_P, ENET_TRD3_N, ENET_TRD3_P, GEN0_SCL, GEN0_SDA

### Nets
3V3_SYS: C35.2 C36.2 D6.A IC7.1(A0) IC7.2(A1) IC7.16(VCC) R34.2 R35.2 R36.2 R37.2 R38.1
EGND: C34.2 J9.S(SHIELD)
GND: C33.1 C34.1 C35.1 C36.1 IC6.2(GND) IC7.3(A2) IC7.4(P0) IC7.5(P1) IC7.6(P2) IC7.7(P3) IC7.8(GND) IC7.9(P4) IC7.10(P5) IC7.11(P6) IC7.12(P7) R39.1
EEPROM_PWR: D6.C IC6.4(VCC)
ENET_LED0: J9.14 ; port ENET_LED0
ENET_LED1: J9.12 ; port ENET_LED1
ENET_TRD0_N: J9.1(D0-) ; port ENET_TRD0_N
ENET_TRD0_P: J9.2(D0+) ; port ENET_TRD0_P
ENET_TRD1_N: J9.3(D1-) ; port ENET_TRD1_N
ENET_TRD1_P: J9.4(D1+) ; port ENET_TRD1_P
ENET_TRD2_N: J9.7(D2-) ; port ENET_TRD2_N
ENET_TRD2_P: J9.8(D2+) ; port ENET_TRD2_P
ENET_TRD3_N: J9.9(D3-) ; port ENET_TRD3_N
ENET_TRD3_P: J9.10(D3+) ; port ENET_TRD3_P
GEN0_SCL: IC6.1(SCL) IC7.14(SCL) R37.1 ; port GEN0_SCL
GEN0_SDA: IC6.3(SDA) IC7.15(SDA) R36.1 ; port GEN0_SDA
SN_WP: IC6.5(WP) IC7.13(~{WC}) R38.2 R39.2
NetC33_2: C33.2 J9.5(CTREF) J9.6(CTREF)
NetJ9_11: J9.11 R34.1
NetJ9_13: J9.13 R35.1

### Layout directives
net class Z_100: ENET_TRD0_N, ENET_TRD0_P, ENET_TRD1_N, ENET_TRD1_P, ENET_TRD2_N, ENET_TRD2_P, ENET_TRD3_N, ENET_TRD3_P
differential pair: ENET_TRD0_N, ENET_TRD0_P, ENET_TRD1_N, ENET_TRD1_P, ENET_TRD2_N, ENET_TRD2_P, ENET_TRD3_N, ENET_TRD3_P

### Notes on the sheet
- ETHERNET INTERFACE
- EEPROM with Unique ID
- TX2 uses RM24C128
- GPIO expander
- 0x58h - SN
- (near IC6) I2C address:
- 0x50h - memory
- (near R39) Short to enable SN write!
- (near IC7) 0x23h - I/O
- (near IC7) I2C address:
- 0x53h - memory
- (near IC7) Use BCD for writing hardware revision
- Title
- Size:
- Date:
- A3
- Number:
- Time:
- Revision:
- Sheet
- of
- Go360.io
- (in symbol WE_7499111447) Y; G

### Library data of the parts
C33 = C_10n_0402: MLCC SMT Capacitor 10 nF 0402; Manufacturer: AVX; PartSymbol: 04025G103ZAT2A; PartNumber: C_10n_0402; Value: 10n
C34 = C_47u_0805: MLCC SMT Capacitor 100pF 0805; PartNumber: C_100p_0805; PartSymbol: 08051A101JAT2A; Value: 100p
C35 C36 = C_100n_0402: as C1 on sheet CSI; PartNumber: C_100n_0402; Value: 100n
D6 = diode: as D1 on sheet Display; PartNumber: 1N914BWS; Value: 1N914BWS; PartSymbol: 1N914BWS
IC6 = AT24CS01: Manufacturer: Atmel; PartNumber: AT24CS01-ST; PartSymbol: AT24CS01-ST; Value: AT24CS01-ST
IC7 = PCA9500PW: Remote 8bit I2C SMBus I/O expander w/ 2kbit EEPROM memory; Manufacturer: NXP Semicondutors; PartNumber: PCA9500PW; Value: PCA9500PW; PartSymbol: PCA9500PW
J9 = WE_7499111447: LAN-Transformer WE-RJ45LAN 10/100/1000 BaseT; PartNumber: WE_7499110124; Value: WE_7499110124; PartSymbol: WE_7499110124
R34 R35 = R_220R_0402: RES, 220R, 0402; Manufacturer: TE CONECTIVITY; PartSymbol: CRG0402J220R; PartNumber: R_220R_0402; Value: 220R
R36 R37 = R_2k_0402: as R28 on sheet Display; PartNumber: R_2k_0402; Value: 2k
R38 = R_100k_0402: as R23 on sheet Display; PartNumber: R_100k_0402; Value: 100k
R39 = R_0R_0402: as R107 on sheet Display; PartNumber: R_0R_0402; Value: 0R

## Sheet NVME.SchDoc
size A3
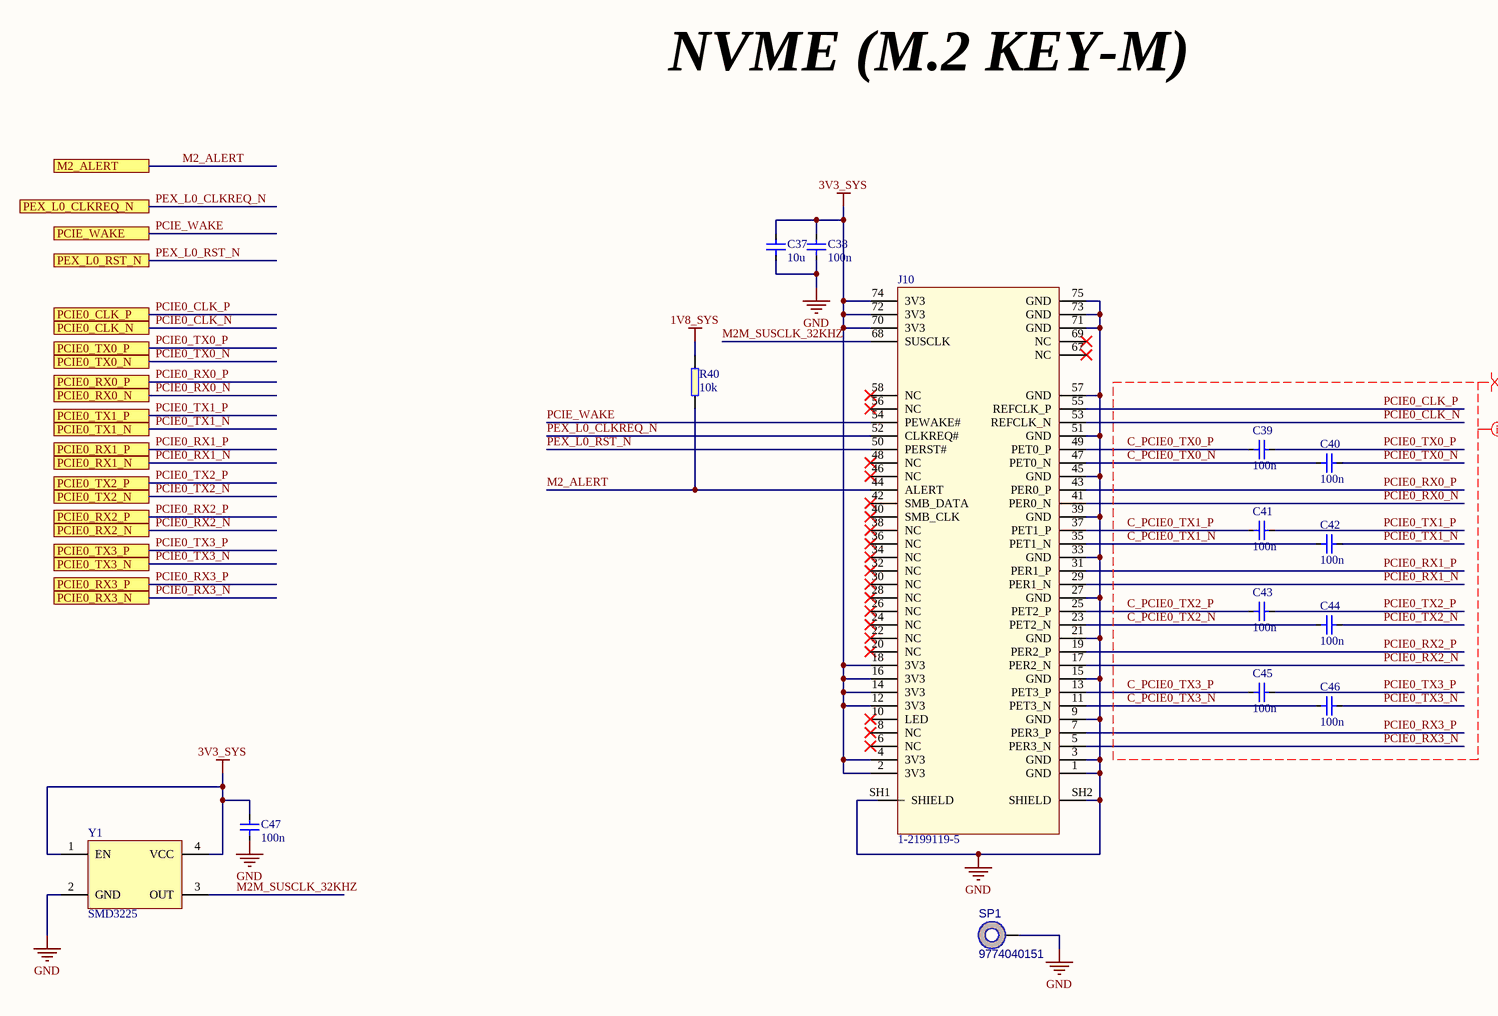
[diagram p3: NVME.SchDoc]

### Parts
C37  10u  [C0402]
C38  100n  [C0402]
C39  100n  [C0402]
C40  100n  [C0402]
C41  100n  [C0402]
C42  100n  [C0402]
C43  100n  [C0402]
C44  100n  [C0402]
C45  100n  [C0402]
C46  100n  [C0402]
C47  100n  [C0402]
J10  1-2199119-5  [1-2199119-5]
R40  10k  [R0402]
SP1  9774040151  [MEC_STANDOFF_PTH_620C380P]
Y1  SMD3225  [XTAL_SMD_4_032X025_D]

### Ports
M2_ALERT, PCIE0_CLK_N, PCIE0_CLK_P, PCIE0_RX0_N, PCIE0_RX0_P, PCIE0_RX1_N, PCIE0_RX1_P, PCIE0_RX2_N, PCIE0_RX2_P, PCIE0_RX3_N, PCIE0_RX3_P, PCIE0_TX0_N, PCIE0_TX0_P, PCIE0_TX1_N, PCIE0_TX1_P, PCIE0_TX2_N, PCIE0_TX2_P, PCIE0_TX3_N, PCIE0_TX3_P, PCIE_WAKE, PEX_L0_CLKREQ_N, PEX_L0_RST_N

### Nets
1V8_SYS: R40.2
3V3_SYS: C37.2 C38.2 C47.2 J10.2(3V3) J10.4(3V3) J10.12(3V3) J10.14(3V3) J10.16(3V3) J10.18(3V3) J10.70(3V3) J10.72(3V3) J10.74(3V3) Y1.1(EN) Y1.4(VCC)
GND: C37.1 C38.1 C47.1 J10.1(GND) J10.3(GND) J10.9(GND) J10.15(GND) J10.21(GND) J10.27(GND) J10.33(GND) J10.39(GND) J10.45(GND) J10.51(GND) J10.57(GND) J10.71(GND) J10.73(GND) J10.75(GND) J10.SH1(SHIELD) J10.SH2(SHIELD) SP1.1 Y1.2(GND)
C_PCIE0_TX0_N: C40.1 J10.47(PET0_N)
C_PCIE0_TX0_P: C39.1 J10.49(PET0_P)
C_PCIE0_TX1_N: C42.1 J10.35(PET1_N)
C_PCIE0_TX1_P: C41.1 J10.37(PET1_P)
C_PCIE0_TX2_N: C44.1 J10.23(PET2_N)
C_PCIE0_TX2_P: C43.1 J10.25(PET2_P)
C_PCIE0_TX3_N: C46.1 J10.11(PET3_N)
C_PCIE0_TX3_P: C45.1 J10.13(PET3_P)
M2_ALERT: J10.44(ALERT) R40.1 ; port M2_ALERT
M2M_SUSCLK_32KHZ: J10.68(SUSCLK) Y1.3(OUT)
PCIE0_CLK_N: J10.53(REFCLK_N) ; port PCIE0_CLK_N
PCIE0_CLK_P: J10.55(REFCLK_P) ; port PCIE0_CLK_P
PCIE0_RX0_N: J10.41(PER0_N) ; port PCIE0_RX0_N
PCIE0_RX0_P: J10.43(PER0_P) ; port PCIE0_RX0_P
PCIE0_RX1_N: J10.29(PER1_N) ; port PCIE0_RX1_N
PCIE0_RX1_P: J10.31(PER1_P) ; port PCIE0_RX1_P
PCIE0_RX2_N: J10.17(PER2_N) ; port PCIE0_RX2_N
PCIE0_RX2_P: J10.19(PER2_P) ; port PCIE0_RX2_P
PCIE0_RX3_N: J10.5(PER3_N) ; port PCIE0_RX3_N
PCIE0_RX3_P: J10.7(PER3_P) ; port PCIE0_RX3_P
PCIE0_TX0_N: C40.2 ; port PCIE0_TX0_N
PCIE0_TX0_P: C39.2 ; port PCIE0_TX0_P
PCIE0_TX1_N: C42.2 ; port PCIE0_TX1_N
PCIE0_TX1_P: C41.2 ; port PCIE0_TX1_P
PCIE0_TX2_N: C44.2 ; port PCIE0_TX2_N
PCIE0_TX2_P: C43.2 ; port PCIE0_TX2_P
PCIE0_TX3_N: C46.2 ; port PCIE0_TX3_N
PCIE0_TX3_P: C45.2 ; port PCIE0_TX3_P
PCIE_WAKE: J10.54(PEWAKE#) ; port PCIE_WAKE
PEX_L0_CLKREQ_N: J10.52(CLKREQ#) ; port PEX_L0_CLKREQ_N
PEX_L0_RST_N: J10.50(PERST#) ; port PEX_L0_RST_N

Not connected (* = marked no-connect by the designer): J10 6(NC)* 8(NC)* 10(LED)* 20(NC)* 22(NC)* 24(NC)* 26(NC)* 28(NC)* 30(NC)* 32(NC)* 34(NC)* 36(NC)* 38(NC)* 40(SMB_CLK)* 42(SMB_DATA)* 46(NC)* 48(NC)* 56(NC)* 58(NC)* 67(NC)* 69(NC)*

### Layout directives
differential pair: C_PCIE0_TX0_N, C_PCIE0_TX0_P, C_PCIE0_TX1_N, C_PCIE0_TX1_P, C_PCIE0_TX2_N, C_PCIE0_TX2_P, C_PCIE0_TX3_N, C_PCIE0_TX3_P, PCIE0_CLK_N, PCIE0_CLK_P, PCIE0_RX0_N, PCIE0_RX0_P, PCIE0_RX1_N, PCIE0_RX1_P, PCIE0_RX2_N, PCIE0_RX2_P, PCIE0_RX3_N, PCIE0_RX3_P, PCIE0_TX0_N, PCIE0_TX0_P, PCIE0_TX1_N, PCIE0_TX1_P, PCIE0_TX2_N, PCIE0_TX2_P, PCIE0_TX3_N, PCIE0_TX3_P
net class Z_85: C_PCIE0_TX0_N, C_PCIE0_TX0_P, C_PCIE0_TX1_N, C_PCIE0_TX1_P, C_PCIE0_TX2_N, C_PCIE0_TX2_P, C_PCIE0_TX3_N, C_PCIE0_TX3_P, PCIE0_CLK_N, PCIE0_CLK_P, PCIE0_RX0_N, PCIE0_RX0_P, PCIE0_RX1_N, PCIE0_RX1_P, PCIE0_RX2_N, PCIE0_RX2_P, PCIE0_RX3_N, PCIE0_RX3_P, PCIE0_TX0_N, PCIE0_TX0_P, PCIE0_TX1_N, PCIE0_TX1_P, PCIE0_TX2_N, PCIE0_TX2_P, PCIE0_TX3_N, PCIE0_TX3_P

### Notes on the sheet
- NVME (M.2 KEY-M)
- Title
- Size:
- Date:
- A3
- Number:
- Time:
- Revision:
- Sheet
- of
- Go360.io

### Library data of the parts
C37 = C_10u_0402: MLCC SMT Capacitor 10uF 0402; Manufacturer: TDK; PartSymbol: C1005X5R0J106M050BC; PartNumber: C_10u_0402; Value: 10u
C38-C47 = C_100n_0402: as C1 on sheet CSI; PartNumber: C_100n_0402; Value: 100n
J10 = 1-2199119-5: CONN FEMALE 67POS 0.020 GOLD; Manufacturer: TE; PartNumber: 1-2199119-5; Value: 1-2199119-5
R40 = R_10k_0402: RES, 10k, 0402; Manufacturer: MULTICOMP; PartSymbol: MCMR04X1002FTL; PartNumber: R_10k_0402; Value: 10k
SP1 = 9774040151: RND STANDOFF M2.5X0.45 STEEL 4MM; Manufacturer: WURTH ELEKTRONIK; PartNumber: 9774040151; Value: 9774040151; PartSymbol: 9774040151

## Sheet POWER.SchDoc
size A3
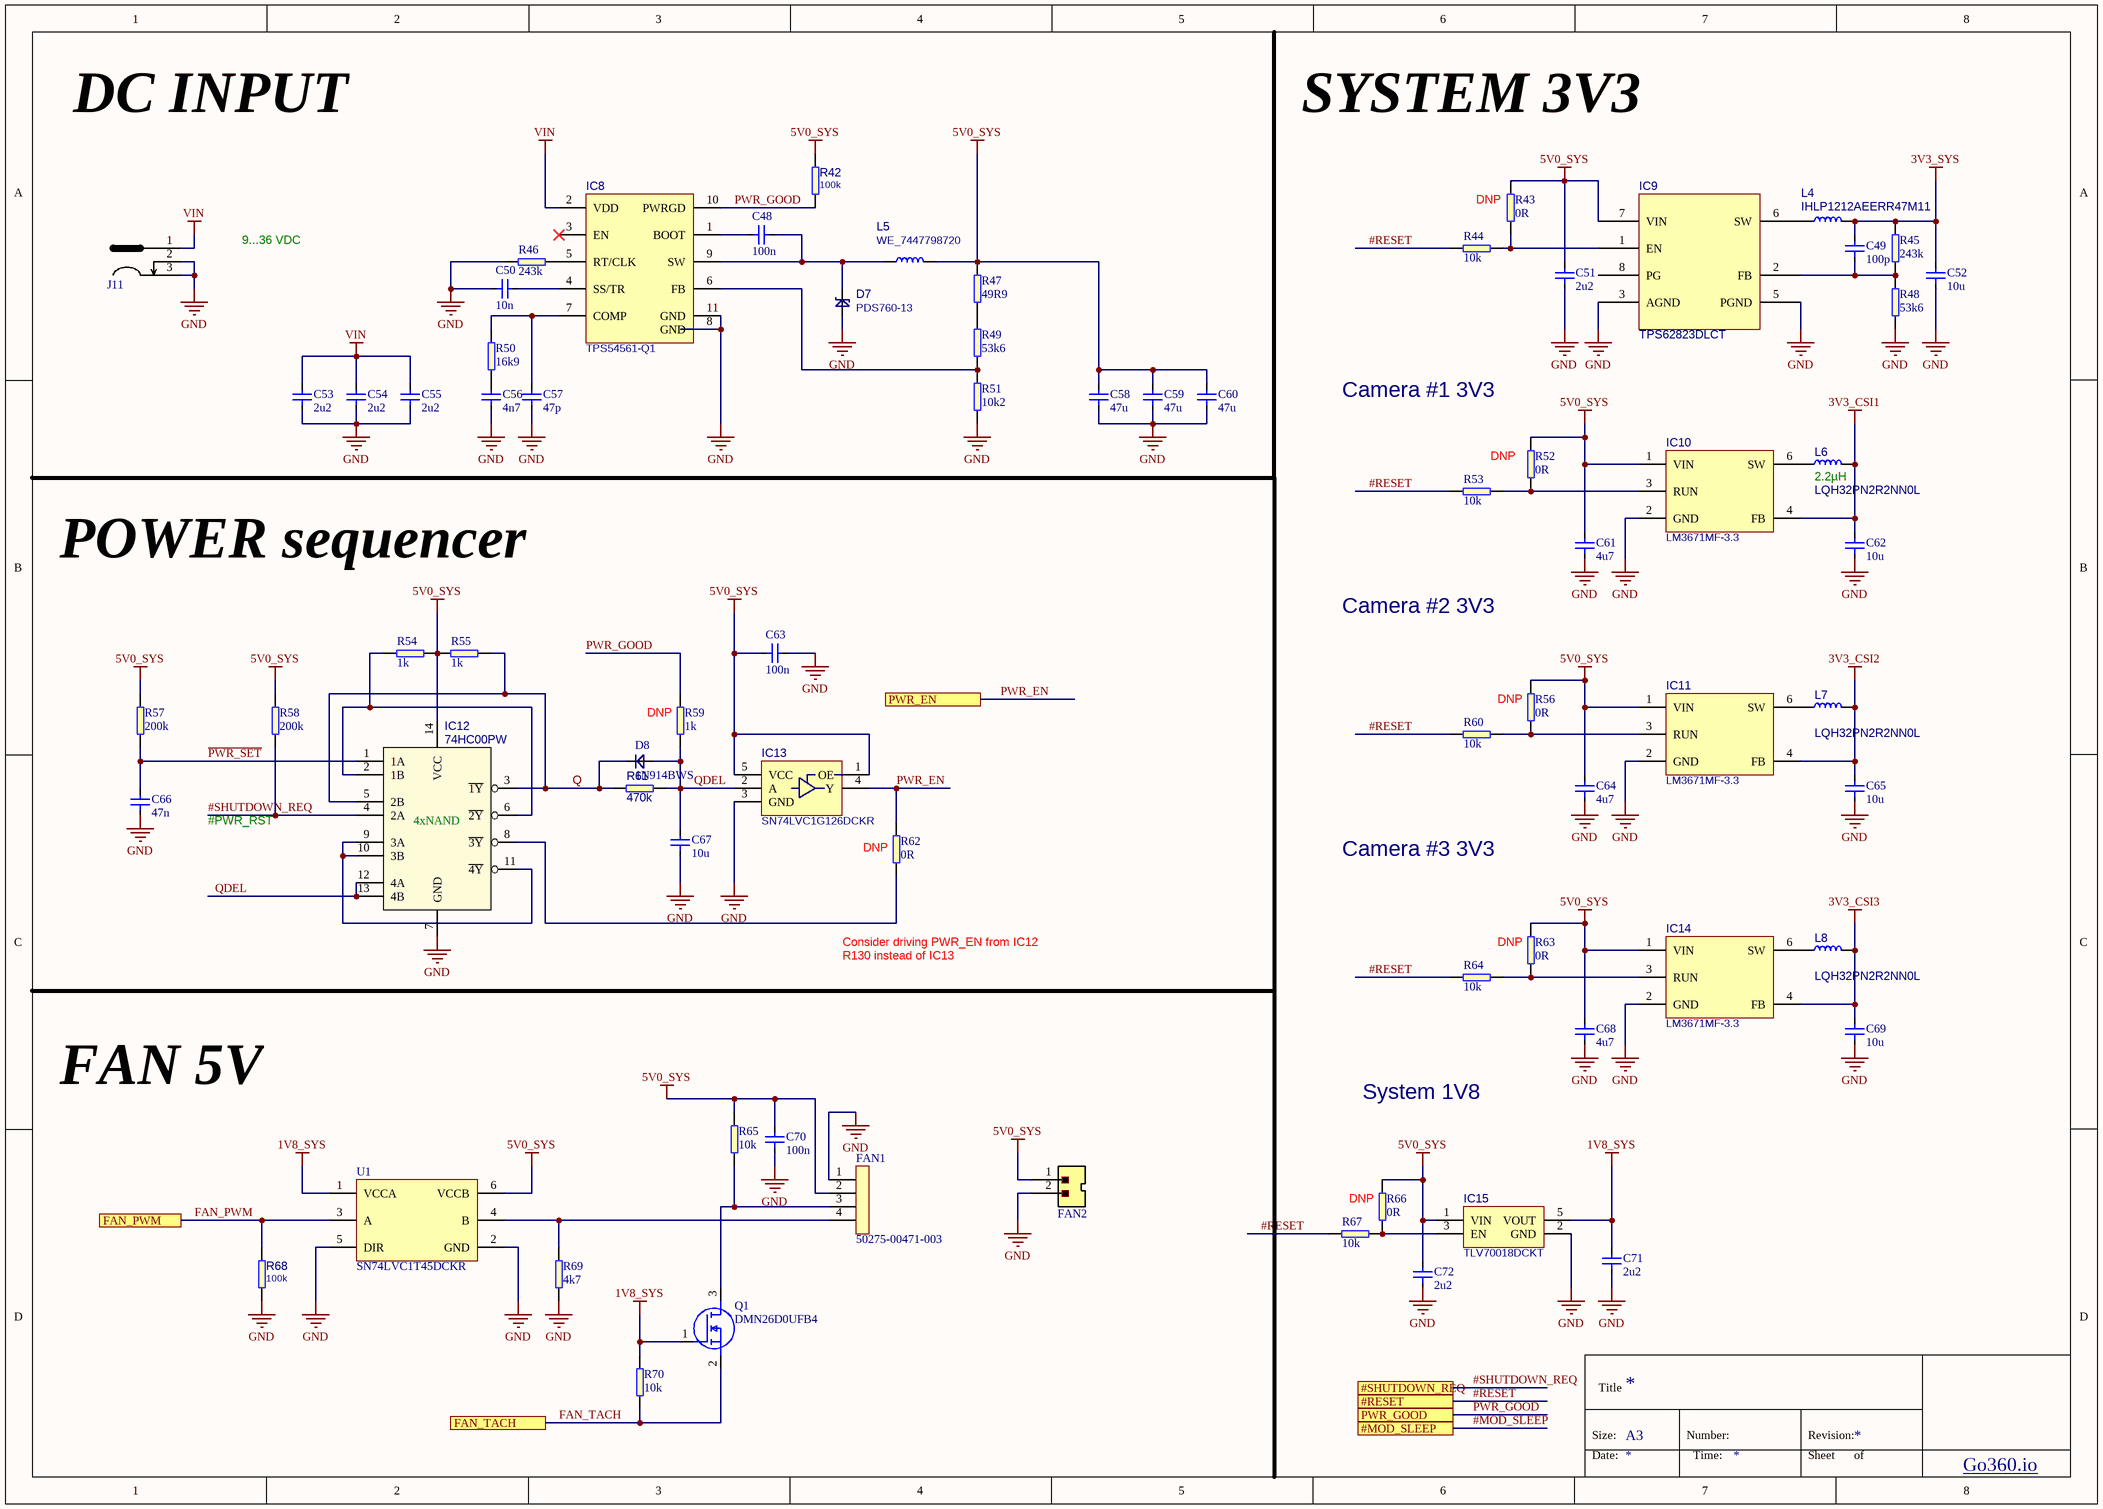
[diagram p4: POWER.SchDoc]

### Parts
C48  100n  [C0402]
C49  100p  [C0402]
C50  10n  [C0402]
C51  2u2  [C0402]
C52  10u  [C0603]
C53  2u2  [1206]
C54  2u2  [1206]
C55  2u2  [1206]
C56  4n7  [C0402]
C57  47p  [C0402]
C58  47u  [0805]
C59  47u  [0805]
C60  47u  [0805]
C61  4u7  [C0402]
C62  10u  [C0603]
C63  100n  [C0402]
C64  4u7  [C0402]
C65  10u  [C0603]
C66  47n  [C0402]
C67  10u  [C0603]
C68  4u7  [C0402]
C69  10u  [C0603]
C70  100n  [C0402]
C71  2u2  [C0402]
C72  2u2  [C0402]
D7  PDS760-13  [PowerDI]
D8  1N914BWS  [SOD-323]
FAN1  50275-00471-003  [CON_MISC_004_TH_ST_M_P013_WTB]
FAN2  MX-22-23-2021  [molex_2223-2021]  (value not drawn)
IC8  TPS54561-Q1  [WSON-10_4x4]
IC9  TPS62823DLCT  [TPS62823]
IC10  LM3671MF-3.3  [SOT23-5N]
IC11  LM3671MF-3.3  [SOT23-5N]
IC12  74HC00PW  [TSSOP-14]
IC13  SN74LVC1G126DCKR  [R-PDSO-G5]
IC14  LM3671MF-3.3  [SOT23-5N]
IC15  TLV70018DCKT  [SC70-5]
J11  DC-005-5A-2.5  [DC_SOCKET]  (value not drawn)
L4  IHLP1212AEERR47M11  [IHLP-1212AE]
L5  WE_7447798720  [WE_7447798720]
L6  LQH32PN2R2NN0L  [LQH32PN2R2NN0L]
L7  LQH32PN2R2NN0L  [LQH32PN2R2NN0L]
L8  LQH32PN2R2NN0L  [LQH32PN2R2NN0L]
Q1  DMN26D0UFB4  [DMN26D0UFB47]
R42  100k  [R0402]
R43  0R  [R0402]
R44  10k  [R0402]
R45  243k  [R0402]
R46  243k  [R0402]
R47  49R9  [R0402]
R48  53k6  [R0402]
R49  53k6  [R0402]
R50  16k9  [R0402]
R51  10k2  [R0402]
R52  0R  [R0402]
R53  10k  [R0402]
R54  1k  [R0402]
R55  1k  [R0402]
R56  0R  [R0402]
R57  200k  [R0402]
R58  200k  [R0402]
R59  1k  [R0402]
R60  10k  [R0402]
R61  470k  [R0402]
R62  0R  [R0402]
R63  0R  [R0402]
R64  10k  [R0402]
R65  10k  [R0402]
R66  0R  [R0402]
R67  10k  [R0402]
R68  100k  [R0402]
R69  4k7  [R0402]
R70  10k  [R0402]
U1  SN74LVC1T45DCKR  [SC70_6]

### Ports
#MOD_SLEEP, #RESET, #SHUTDOWN_REQ, FAN_PWM, FAN_TACH, PWR_EN, PWR_GOOD

### Nets
1V8_SYS: C71.2 IC15.5(VOUT) Q1.1(G) R70.2 U1.1(VCCA)
3V3_CSI1: C62.2 IC10.4(FB) L6.2
3V3_CSI2: C65.2 IC11.4(FB) L7.2
3V3_CSI3: C69.2 IC14.4(FB) L8.2
3V3_SYS: C49.2 C52.2 L4.2 R45.2
5V0_SYS: C51.2 C58.2 C59.2 C60.2 C61.2 C63.1 C64.2 C68.2 C70.2 C72.2 FAN1.2 FAN2.1 IC9.7(VIN) IC10.1(VIN) IC11.1(VIN) IC12.14(VCC) IC13.1(OE) IC13.5(VCC) IC14.1(VIN) IC15.1(VIN) L5.2 R42.1 R43.2 R47.2 R52.2 R54.2 R55.1 R56.2 R57.2 R58.2 R63.2 R65.2 R66.2 U1.6(VCCB)
GND: C50.1 C51.1 C52.1 C53.1 C54.1 C55.1 C56.1 C57.1 C58.1 C59.1 C60.1 C61.1 C62.1 C63.2 C64.1 C65.1 C66.1 C67.1 C68.1 C69.1 C70.1 C71.1 C72.1 D7.A FAN1.1 FAN2.2 IC8.8(GND) IC8.11(GND) IC9.3(AGND) IC9.5(PGND) IC10.2(GND) IC11.2(GND) IC12.7(GND) IC13.3(GND) IC14.2(GND) IC15.2(GND) J11.2 J11.3 R46.1 R48.1 R51.1 R68.2 R69.1 U1.2(GND) U1.5(DIR)
VIN: C53.2 C54.2 C55.2 IC8.2(VDD) J11.1
#MOD_SLEEP: port #MOD_SLEEP
#RESET: R44.1 R53.1 R60.1 R64.1 R67.1 ; port #RESET
#SHUTDOWN_REQ: IC12.4(2A) R58.1 ; port #SHUTDOWN_REQ
~{PWR_SET}: C66.2 IC12.1(1A) R57.1
FAN_PWM: R68.1 U1.3(A) ; port FAN_PWM
FAN_TACH: Q1.2(S) R70.1 ; port FAN_TACH
PWR_EN: IC13.4(Y) R62.2 ; port PWR_EN
PWR_GOOD: IC8.10(PWRGD) R42.2 R59.2 ; port PWR_GOOD
Q: D8.C IC12.3(~{1Y}) IC12.5(2B) R55.2 R61.1
QDEL: C67.2 D8.A IC12.12(4A) IC12.13(4B) IC13.2(A) R59.1 R61.2
NetC48_1: C48.1 IC8.1(BOOT)
NetC48_2: C48.2 D7.C IC8.9(SW) L5.1
NetC49_1: C49.1 IC9.2(FB) R45.1 R48.2
NetC50_2: C50.2 IC8.4(SS/TR)
NetC56_2: C56.2 R50.1
NetC57_2: C57.2 IC8.7(COMP) R50.2
NetFAN1_3: FAN1.3 Q1.3(D) R65.1
NetFAN1_4: FAN1.4 R69.2 U1.4(B)
NetIC8_5: IC8.5(RT/CLK) R46.2
NetIC8_6: IC8.6(FB) R49.1 R51.2
NetIC9_1: IC9.1(EN) R43.1 R44.2
NetIC9_6: IC9.6(SW) L4.1
NetIC10_3: IC10.3(RUN) R52.1 R53.2
NetIC10_6: IC10.6(SW) L6.1
NetIC11_3: IC11.3(RUN) R56.1 R60.2
NetIC11_6: IC11.6(SW) L7.1
NetIC12_2: IC12.2(1B) IC12.6(~{2Y}) R54.1
NetIC12_8: IC12.8(~{3Y}) R62.1
NetIC12_9: IC12.9(3A) IC12.10(3B) IC12.11(~{4Y})
NetIC14_3: IC14.3(RUN) R63.1 R64.2
NetIC14_6: IC14.6(SW) L8.1
NetIC15_3: IC15.3(EN) R66.1 R67.2
NetR47_1: R47.1 R49.2

Not connected (* = marked no-connect by the designer): IC8 3(EN)*; IC9 8(PG)

### Notes on the sheet
- DC INPUT
- SYSTEM 3V3
- 9...36 VDC
- (near R43) DNP
- Camera #1 3V3
- DNP
- (near L6) 2.2µH
- POWER sequencer
- Camera #2 3V3
- (near R59) DNP
- (near R56) DNP
- #PWR_RST
- (near R62) DNP
- Camera #3 3V3
- R130 instead of IC13
- Consider driving PWR_EN from IC12
- (near R63) DNP
- FAN 5V
- System 1V8
- Title
- Size:
- Date:
- A3
- Number:
- Time:
- Revision:
- Sheet
- of
- Go360.io
- (in symbol 74HC00PW) 4xNAND

### Library data of the parts
C48 C63 C70 = C_100n_0402: as C1 on sheet CSI; PartNumber: C_100n_0402; Value: 100n
C49 = C_100p_0402: MLCC SMT Capacitor 100p 0402; Manufacturer: AVX; PartSymbol: 04023A101JAT2A; PartNumber: C_100p_0402; Value: 100p
C50 = C_10n_0402: as C33 on sheet ETHERNET; PartNumber: C_10n_0402; Value: 10n
C51 C71 C72 = C_2u2_0402: MLCC SMT Capacitor 2.2uF 0402; Manufacturer: TDK; PartSymbol: C1005X5R1A225K050BC; PartNumber: C_2u2_0402; Value: 2u2
C52 C62 C65 C67 C69 = C_10u_0603: MLCC SMT Capacitor 10uF 0603; Manufacturer: Walsin; PartSymbol: 0603X106M6R3CT; PartNumber: C_10u_0603; Value: 10u
C53-C55 = C_2u2_1206: MLCC SMT Capacitor 2.2uF 1206; Manufacturer: KEMET; PartSymbol: C1206C225J5RACTU; PartNumber: C_2u2_1206; Value: 2u2
C56 = C_4n7_0402: MLCC SMT Capacitor 4.7 nF 0402; Manufacturer: TDK; PartSymbol: CGA2B3X7S2A472K050BB; PartNumber: C_4n7_0402; Value: 4n7
C57 = C_47p_0402: MLCC SMT Capacitor 47pF 0402; Manufacturer: KEMET; PartSymbol: C0402C470J5GACTU; PartNumber: C_47p_0402; Value: 47p
C58-C60 = C_47u_0805: MLCC SMT Capacitor 47uF 0805; Manufacturer: KEMET; PartSymbol: C0805C476M9PACTU; PartNumber: C_47u_0805; Value: 47u
C61 C64 C68 = C_4u7_0402: as C16 on sheet Display; PartNumber: C_4u7_0402; Value: 4u7
C66 = C_47n_0402: MLCC SMT Capacitor 47nF 0402; Manufacturer: MULTICOMP; PartSymbol: MC0402X473K160CT; PartNumber: C_47n_0402; Value: 47n
D7 = Diode Schottky: DIODE SCHOTTKY 60V 7A POWERDI5; Manufacturer: DIODES INC.; PartNumber: PDS760-13; Value: PDS760-13; PartSymbol: PDS760-13
D8 = diode: as D1 on sheet Display; PartNumber: 1N914BWS; Value: 1N914BWS; PartSymbol: 1N914BWS
FAN2 = molex_2223-2021: Pinhead connector with key; Manufacturer: Molex; PartSymbol: 022232021 A-6373-02A222; Value: MX-22-23-2021; PartNumber: molex_2223-2021
IC8 = TPS54561: IC REG BCK SPLIT RAIL ADJ 10WSON; Manufacturer: TEXAS INSTRUMENTS; PartNumber: TPS54561-Q1; Value: TPS54561-Q1; PartSymbol: TPS54561-Q1
IC9 = TPS62823: IC REG BUCK ADJ 1A 8VSON-HR; Manufacturer: TEXAS INSTRUMENTS; PartNumber: TPS62823; Value: TPS62823DLCT; PartSymbol: TPS62823DLCT; Class: IC
IC10 IC11 IC14 = LM3671: DC/DC Buck Converter; Manufacturer: TEXAS INSTRUMENTS; PartSymbol: LM3671MF-3.3/NOPB; Value: LM3671MF-3.3; PartNumber: LM3671MF-3.3
IC12 = 74HC00PW: 2 NAND Gate, 4 channel; Manufacturer: NEXPERIA; PartNumber: 74HC00PW; Value: 74HC00PW; PartSymbol: 74HC00PW
IC13 = SN74LVC1G126: Buffer, tri-state; Manufacturer: Texas Instruments; PartNumber: SN74LVC1G126DCKR; Value: SN74LVC1G126DCKR; PartSymbol: SN74LVC1G126DCKR
IC15 = TLV700: Voltage Regulator, 2V to 5.5V, 175mV Dropout, 1.8Vout, 200mAout; Manufacturer: TEXAS INSTRUMENTS; Value: TLV70018DCKT; PartNumber: TLV70018DCKT; PartSymbol: TLV70018DCKT
J11 = DC_SOCKET: DC Power Connector, Jack, 4 A, 1.95 mm, PCB Mount, Through Hole; Manufacturer: XKB Connectivity; PartNumber: DC-005-5A-2.5; PartSymbol: DC-005-5A-2.5; Value: DC-005-5A-2.5
L4 = IHLP1212AEERR47M11: FIXED IND 470NH 6.7A 15 MOHM SMD; Manufacturer: VISHAY; Class: Inductance; PartNumber: IHLP1212AEERR47M11; Value: IHLP1212AEERR47M11; PartSymbol: IHLP1212AEERR47M11; Inductance: 470nH; RatedCurrent: 6.7A
L5 = WE_7447798720: Fixed Inductors WE-PDF 1064 7.2uH 7.9A 12.8mOhm; Manufacturer: WURTH ELEKTRONIK; PartNumber: WE_7447798720; Value: WE_7447798720; PartSymbol: 7447798720; Inductance: 7.2uH; RatedCurrent: 7.9A
L6-L8 = LQH32PN2R2NN0L: INDUCTOR, 2.2 ?H, ? 30%, 1212, 90 MHz, 0.073 ohm; Manufacturer: MURATA; Inductance: 2.2uH; PartNumber: LQH32PN2R2NN0L; Value: LQH32PN2R2NN0L; PartSymbol: LQH32PN2R2NN0L
Q1 = DMN26D0UFB4: MOSFET (N-Channel); Manufacturer_Name: Diodes Inc.; Manufacturer_Part_Number: DMN26D0UFB4-7; Datasheet Link: https://componentsearchengine.com/Datasheets/1/DMN26D0UFB4-7.pdf; Height: 0.4mm; Arrow Part Number: DMN26D0UFB4-7; Arrow Price/Stock: https://www.arrow.com/en/products/dmn26d0ufb4-7/diodes-incorporated; Mouser Part Number: 621-DMN26D0UFB4-7; Mouser Price/Stock: https://www.mouser.co.uk/ProductDetail/Diodes-Incorporated/DMN26D0UFB4-7?qs=GWgl%252BsiMZr%252B4pznsTuF3iQ%3D%3D
R42 R68 = R_100k_0402: as R23 on sheet Display; PartNumber: R_100k_0402; Value: 100k
R43 R52 R56 R62 R63 R66 = R_0R_0402: as R107 on sheet Display; PartNumber: R_0R_0402; Value: 0R
R44 R53 R60 R64 R65 R67 R70 = R_10k_0402: as R40 on sheet NVME; PartNumber: R_10k_0402; Value: 10k
R45 R46 = R_243k_0402: RES, 243k, 0402; Manufacturer: MULTICOMP; PartSymbol: MCMR04X2433FTL; PartNumber: R_243k_0402; Value: 243k
R47 = R_49R9_0402: RES, 49R9, 0402; Manufacturer: VISHAY; PartSymbol: CRCW040249R9FKED; PartNumber: R_49R9_0402; Value: 49R9
R48 R49 = R_53k6_0402: RES, 53k6, 0402; Manufacturer: TE CONECTIVITY; PartSymbol: CPF0402B53K6E1; PartNumber: R_53k6_0402; Value: 53k6
R50 = R_16k9_0402: RES, 16k9, 0402; Manufacturer: Panasonic; PartSymbol: ERA2AEB1692X; PartNumber: R_16k9_0402; Value: 16k9
R51 = R_10k2_0402: RES, 10k2, 0402, 0.1%; PartNumber: R_10k2_0402_0.1%; Manufacturer: TE CONECTIVITY; PartSymbol: CPF0402B10K2E1; Tolerance: 0.1%; Value: 10k2
R54 R55 R59 = R_1k_0402: RES, 1k, 0402; Manufacturer: BOURNS; PartSymbol: CR0402-FX-1001GLF; PartNumber: R_1k_0402; Value: 1k
R57 R58 = R_200k_0402: RES, 200k, 0402; Manufacturer: YAGEO; PartSymbol: RC0402FR-07200KL; PartNumber: R_200k_0402; Value: 200k
R61 = R_470k_0402: SMT Resistor 470k 0402; Manufacturer: VISHAY; PartSymbol: CRCW0402470KFKED; PartNumber: R_470k_0402; Value: 470k
R69 = R_4k7_0402: as R1 on sheet CSI; PartNumber: R_4k7_0402; Value: 4k7

## Sheet USB.SchDoc
size A3
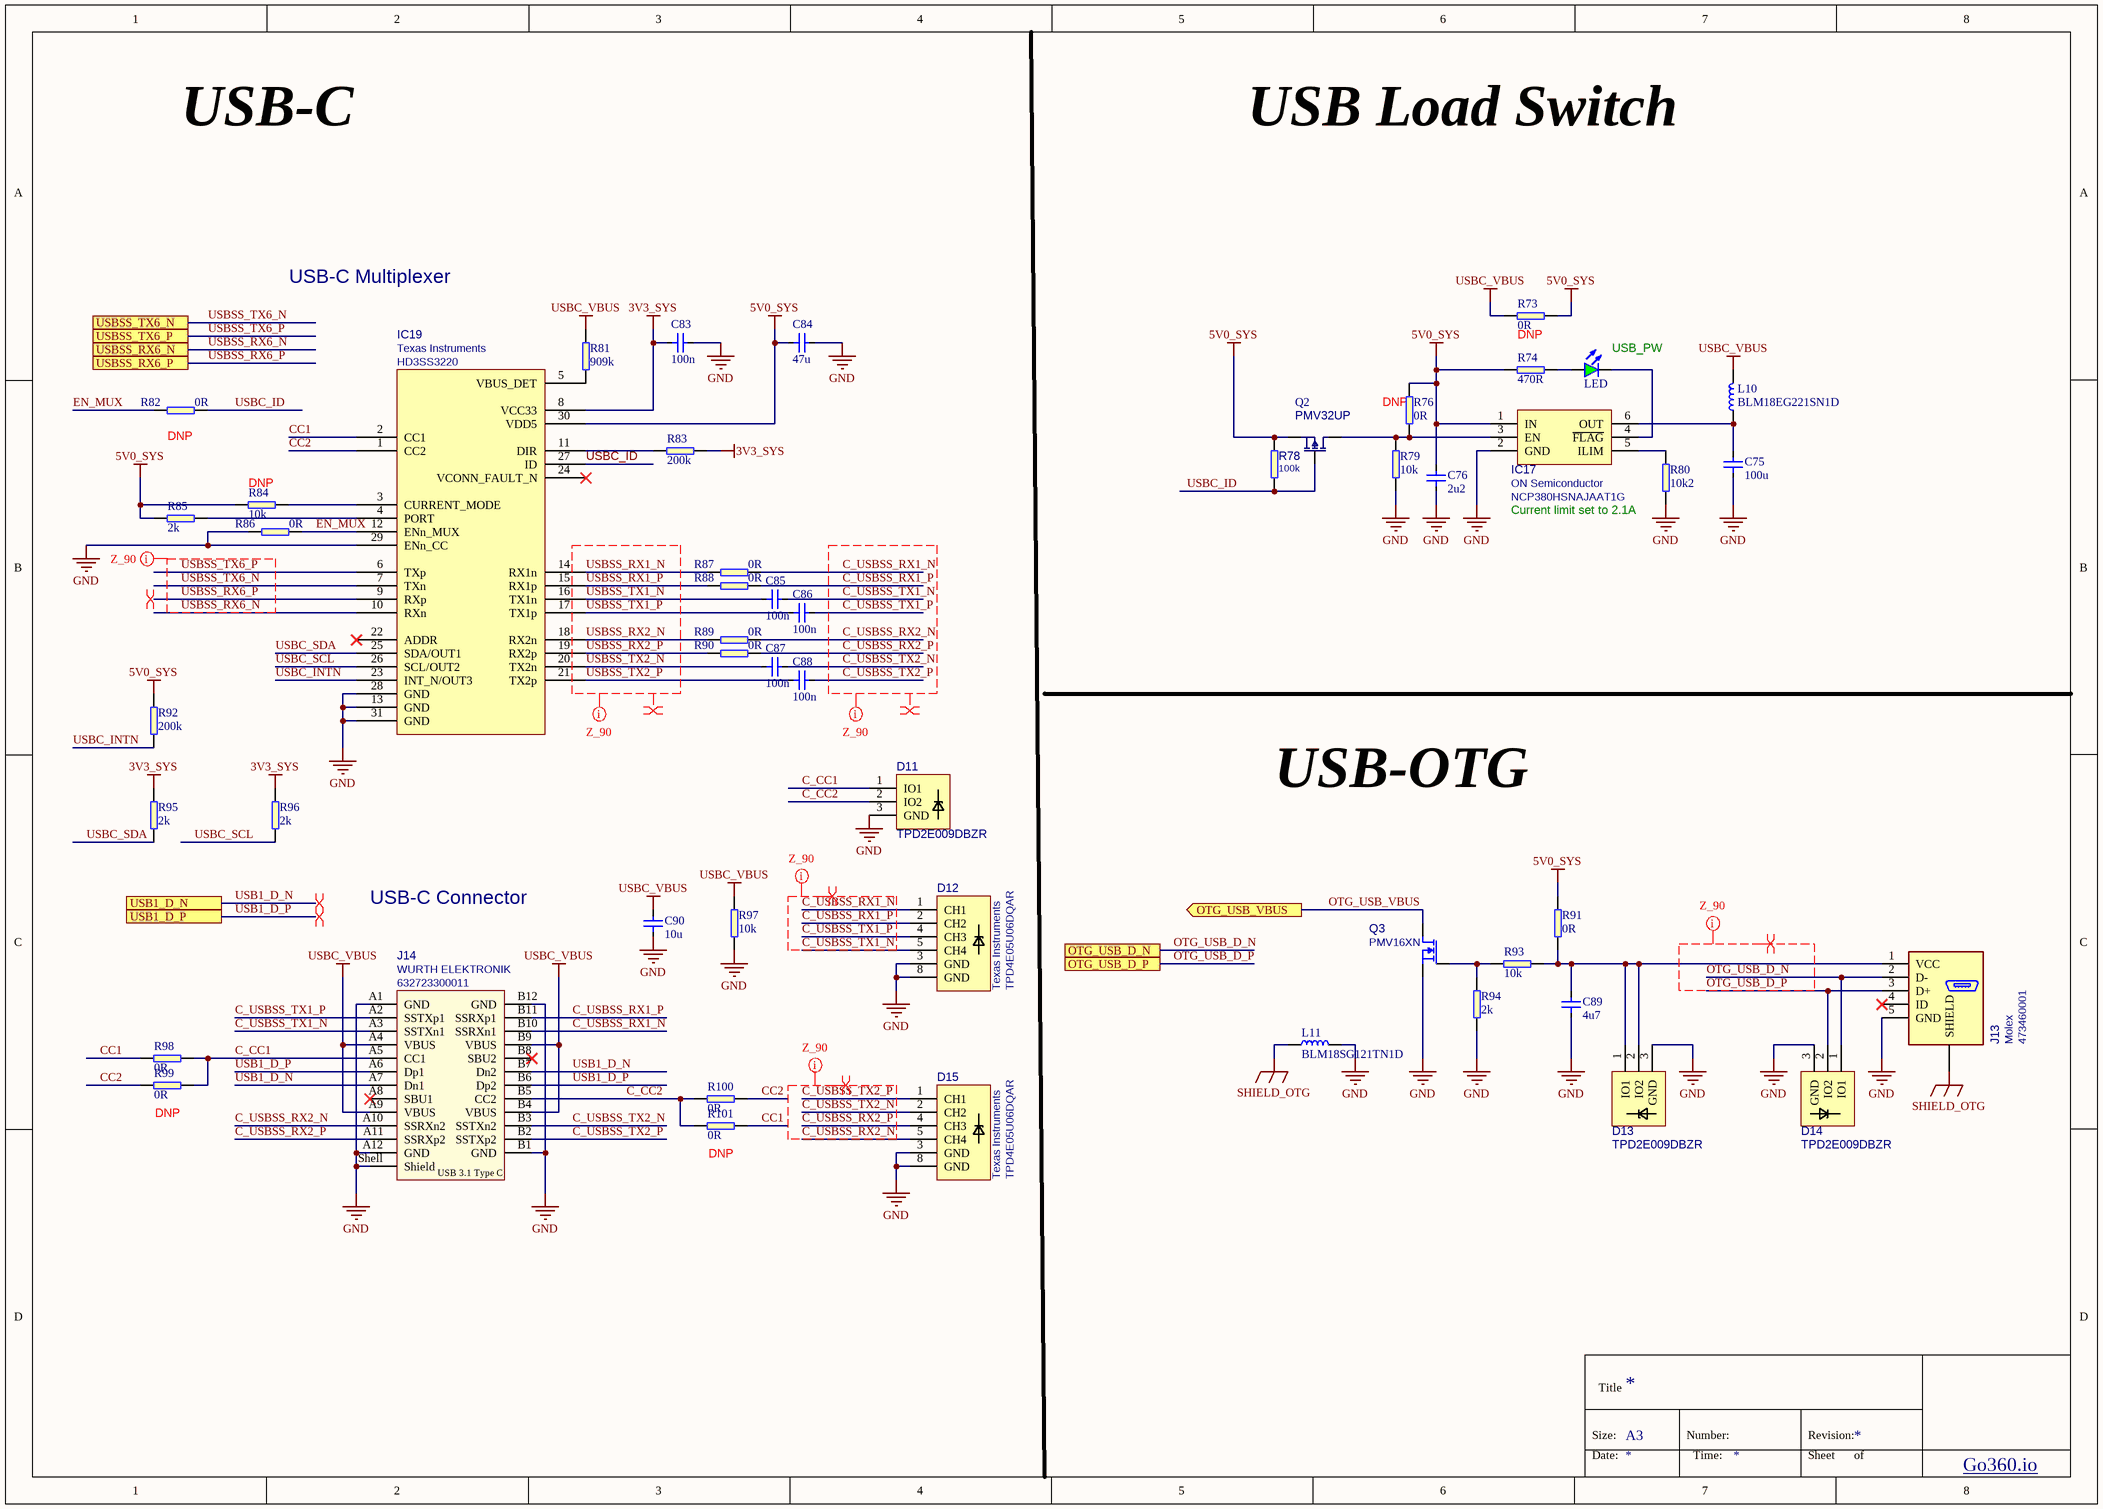
[diagram p5: USB.SchDoc]

### Parts
C75  100u  [1206]
C76  2u2  [C0402]
C83  100n  [C0402]
C84  47u  [0805]
C85  100n  [C0402]
C86  100n  [C0402]
C87  100n  [C0402]
C88  100n  [C0402]
C89  4u7  [C0402]
C90  10u  [C0603]
D11  TPD2E009DBZR  [SOT-23]
D12  Manufacturer: Texas Instruments  PartSymbol: TPD4E05U06DQAR  [TPD4E05U06_PASS]  (hidden comment: TPD4E05U06)
D13  TPD2E009DBZR  [SOT-23s]
D14  TPD2E009DBZR  [SOT-23s]
D15  Manufacturer: Texas Instruments  PartSymbol: TPD4E05U06DQAR  [TPD4E05U06_PASS]  (hidden comment: TPD4E05U06)
IC17  NCP380HSNAJAAT1G  Manufacturer: ON Semiconductor  [TSOP-6]
IC19  HD3SS3220  Manufacturer: Texas Instruments  [RNH0030A]
J13  Manufacturer: Molex  PartSymbol: 473460001  [CON-Molex-047346-0001]  (hidden comment: Molex 47346-0001)
J14  632723300011  Manufacturer: WURTH ELEKTRONIK  [WE_632723300011]
L10  BLM18EG221SN1D  [BEADC1608X65N]
L11  BLM18SG121TN1D  [BEADC1608X65N]
LED  SML-310MTT86  [LED0603]  (value not drawn)
Q2  PMV32UP  [SOT-23s]
Q3  PMV16XN  [SOT-23s]
R73  0R  [R0402]
R74  470R  [R0402]
R76  0R  [R0402]
R78  100k  [R0402]
R79  10k  [R0402]
R80  10k2  [R0402]
R81  909k  [R0402]
R82  0R  [R0402]
R83  200k  [R0402]
R84  10k  [R0402]
R85  2k  [R0402]
R86  0R  [R0402]
R87  0R  [R0402]
R88  0R  [R0402]
R89  0R  [R0402]
R90  0R  [R0402]
R91  0R  [R0402]
R92  200k  [R0402]
R93  10k  [R0402]
R94  2k  [R0402]
R95  2k  [R0402]
R96  2k  [R0402]
R97  10k  [R0402]
R98  0R  [R0402]
R99  0R  [R0402]
R100  0R  [R0402]
R101  0R  [R0402]

### Ports
OTG_USB_D_N, OTG_USB_D_P, OTG_USB_VBUS (out), USB1_D_N, USB1_D_P, USBSS_RX6_N, USBSS_RX6_P, USBSS_TX6_N, USBSS_TX6_P

### Nets
3V3_SYS: C83.1 IC19.8(VCC33) R83.2 R95.2 R96.2
5V0_SYS: C76.2 C84.1 IC17.1(IN) IC19.30(VDD5) Q2.2(S) R73.1 R74.1 R76.2 R78.1 R84.1 R85.1 R91.2 R92.2
GND: C75.1 C76.1 C83.2 C84.2 C89.1 C90.1 D11.3(GND) D12.3(GND) D12.8(GND) D13.3(GND) D14.3(GND) D15.3(GND) D15.8(GND) IC17.2(GND) IC19.13(GND) IC19.28(GND) IC19.29(ENn_CC) IC19.31(GND) J13.5(GND) J14.A1(GND) J14.A12(GND) J14.B1(GND) J14.B12(GND) J14.Shell(Shield) L11.2 Q3.2(S) R79.1 R80.1 R86.2 R94.1 R97.1
SHIELD_OTG: J13.S(SHIELD) L11.1
USBC_VBUS: C90.2 J14.A4(VBUS) J14.A9(VBUS) J14.B4(VBUS) J14.B9(VBUS) L10.2 R73.2 R81.2 R97.2
C_CC1: D11.1(IO1) J14.A5(CC1) R98.2 R99.2
C_CC2: D11.2(IO2) J14.B5(CC2) R100.1 R101.1
C_USBSS_RX1_N: D12.1(CH1) J14.B10(SSRXn1) R87.1
C_USBSS_RX1_P: D12.2(CH2) J14.B11(SSRXp1) R88.1
C_USBSS_RX2_N: D15.5(CH4) J14.A10(SSRXn2) R89.1
C_USBSS_RX2_P: D15.4(CH3) J14.A11(SSRXp2) R90.1
C_USBSS_TX1_N: C85.2 D12.5(CH4) J14.A3(SSTXn1)
C_USBSS_TX1_P: C86.2 D12.4(CH3) J14.A2(SSTXp1)
C_USBSS_TX2_N: C87.2 D15.2(CH2) J14.B3(SSTXn2)
C_USBSS_TX2_P: C88.2 D15.1(CH1) J14.B2(SSTXp2)
CC1: IC19.2(CC1) R98.1 R101.2
CC2: IC19.1(CC2) R99.1 R100.2
EN_MUX: IC19.12(ENn_MUX) R82.2 R86.1
OTG_USB_D_N: D14.1(IO1) J13.2(D-) ; port OTG_USB_D_N
OTG_USB_D_P: D14.2(IO2) J13.3(D+) ; port OTG_USB_D_P
OTG_USB_VBUS: Q3.3(D) ; port OTG_USB_VBUS
USB1_D_N: J14.A7(Dn1) J14.B7(Dn2) ; port USB1_D_N
USB1_D_P: J14.A6(Dp1) J14.B6(Dp2) ; port USB1_D_P
USBC_ID: IC19.27(ID) Q2.1(G) R78.2 R82.1
USBC_INTN: IC19.23(INT_N/OUT3) R92.1
USBC_SCL: IC19.26(SCL/OUT2) R96.1
USBC_SDA: IC19.25(SDA/OUT1) R95.1
USBSS_RX1_N: IC19.14(RX1n) R87.2
USBSS_RX1_P: IC19.15(RX1p) R88.2
USBSS_RX2_N: IC19.18(RX2n) R89.2
USBSS_RX2_P: IC19.19(RX2p) R90.2
USBSS_RX6_N: IC19.10(RXn) ; port USBSS_RX6_N
USBSS_RX6_P: IC19.9(RXp) ; port USBSS_RX6_P
USBSS_TX1_N: C85.1 IC19.16(TX1n)
USBSS_TX1_P: C86.1 IC19.17(TX1p)
USBSS_TX2_N: C87.1 IC19.20(TX2n)
USBSS_TX2_P: C88.1 IC19.21(TX2p)
USBSS_TX6_N: IC19.7(TXn) ; port USBSS_TX6_N
USBSS_TX6_P: IC19.6(TXp) ; port USBSS_TX6_P
NetC75_2: C75.2 IC17.6(OUT) L10.1
NetC89_2: C89.2 D13.1(IO1) D13.2(IO2) J13.1(VCC) R91.1 R93.2
NetIC17_3: IC17.3(EN) Q2.3(D) R76.1 R79.2
NetIC17_4: IC17.4(~{FLAG}) LED.K
NetIC17_5: IC17.5(ILIM) R80.2
NetIC19_3: IC19.3(CURRENT_MODE) R84.2
NetIC19_4: IC19.4(PORT) R85.2
NetIC19_5: IC19.5(VBUS_DET) R81.1
NetIC19_11: IC19.11(DIR) R83.1
NetLED_A: LED.A R74.2
NetQ3_1: Q3.1(G) R93.1 R94.2

Not connected (* = marked no-connect by the designer): IC19 22(ADDR)* 24(VCONN_FAULT_N)*; J13 4(ID)*; J14 A8(SBU1)* B8(SBU2)*

### Layout directives
differential pair: C_USBSS_RX1_N, C_USBSS_RX1_P, C_USBSS_RX2_N, C_USBSS_RX2_P, C_USBSS_TX1_N, C_USBSS_TX1_P, C_USBSS_TX2_N, C_USBSS_TX2_P, OTG_USB_D_N, OTG_USB_D_P, USB1_D_N, USB1_D_P, USBSS_RX1_N, USBSS_RX1_P, USBSS_RX2_N, USBSS_RX2_P, USBSS_RX6_P, USBSS_TX1_N, USBSS_TX1_P, USBSS_TX2_N, USBSS_TX2_P
net class Z_90: C_USBSS_RX1_N, C_USBSS_RX1_P, C_USBSS_RX2_N, C_USBSS_RX2_P, C_USBSS_TX1_N, C_USBSS_TX1_P, C_USBSS_TX2_N, C_USBSS_TX2_P, OTG_USB_D_N, OTG_USB_D_P, USBSS_RX1_N, USBSS_RX1_P, USBSS_RX2_N, USBSS_RX2_P, USBSS_RX6_N, USBSS_RX6_P, USBSS_TX1_N, USBSS_TX1_P, USBSS_TX2_N, USBSS_TX2_P, USBSS_TX6_N, USBSS_TX6_P

### Notes on the sheet
- USB-C
- USB Load Switch
- USB-C Multiplexer
- (near R73) DNP
- (near LED) USB_PW
- (near R82) DNP
- (near R76) DNP
- (near R84) DNP
- (near R80) Current limit set to 2.1A
- USB-OTG
- USB-C Connector
- (near R99) DNP
- (near R101) DNP
- Title
- Size:
- Date:
- A3
- Number:
- Time:
- Revision:
- Sheet
- of
- Go360.io
- (in symbol WE_632723300011) USB 3.1 Type C

### Library data of the parts
C75 = C_100u_1206: MLCC SMT Capacitor 100uF 1206; Manufacturer: Taiyo Yuden; PartSymbol: JMK316BJ107ML-T; PartNumber: C_100u_1206; Value: 100u
C76 = C_2u2_0402: as C51 on sheet POWER; PartNumber: C_2u2_0402; Value: 2u2
C83 C85-C88 = C_100n_0402: as C1 on sheet CSI; PartNumber: C_100n_0402; Value: 100n
C84 = C_47u_0805: as C58 on sheet POWER; PartNumber: C_47u_0805; Value: 47u
C89 = C_4u7_0402: as C16 on sheet Display; PartNumber: C_4u7_0402; Value: 4u7
C90 = C_10u_0603: as C52 on sheet POWER; PartNumber: C_10u_0603; Value: 10u
D11 D13 D14 = TPD2E009DBZR: as D3 on sheet Display; PartNumber: TPD2E009DBZR; Value: TPD2E009DBZR; MPN: TPD2E009DBZR
D12 D15 = TPD4E05U06: ESD Suppressors 4-CH; PartNumber: TPD4E05U06_PASS; Value: TPD4E05U06
IC17 = NCP380HSNAJAAT1G: POWER LOAD SWITCH, HIGH SIDE; Value: NCP380HSNAJAAT1G; PartNumber: NCP380HSNAJAAT1G; PartSymbol: NCP380HSNAJAAT1G
IC19 = HD3SS3220: IC DRP PORT CTLR USB-C 30WQFN; PartSymbol: HD3SS3220RNHT; PartNumber: HD3SS3220; Value: HD3SS3220
J13 = Micro USB B: USB - micro B Receptacle Connector 5 Position Surface Mount, Right Angle, Horizontal; PartNumber: CON-Molex-47346-0001; Value: Molex 47346-0001
J14 = WE_632723300011: USB 3.1 Type C Receptacle Horizontal THR WR-COM; PartNumber: WE_632723300011; Value: 632723300011; PartSymbol: 632723300011
L10 = BLM18EG221SN1D: MURATA  BLM18EG221SN1D  FERRITE BEAD, 0.05OHM, 2A, 0603; PartNumber: BLM18EG221SN1D; Value: BLM18EG221SN1D; Manufacturer: MURATA; PartSymbol: BLM18EG221SN1D
L11 = BLM18SG121TN1D: as L1 on sheet Display; PartNumber: BLM18SG121TN1D; Value: BLM18SG121TN1D; PartSymbol: BLM18SG121TN1D
LED = LED: LED Green 0603 case; Manufacturer: ROHM Semicon; PartNumber: LED_G; Value: SML-310MTT86; PartSymbol: SML-310MTT86
Q2 = PMOS: P CH, 20V, 4A; Manufacturer: NXP; PartNumber: PMV32UP; Value: PMV32UP; PartSymbol: PMV32UP
Q3 = NMOS_PMV16XN: MOSFET, N CH; Manufacturer: NXP; Value: PMV16XN; PartNumber: PMV16XN; PartSymbol: PMV16XN
R73 R76 R82 R86-R91 R98-R101 = R_0R_0402: as R107 on sheet Display; PartNumber: R_0R_0402; Value: 0R
R74 = R_470R_0402: RES, 470R, 0402; Manufacturer: VISHAY; PartSymbol: CRCW0402470RFKED.; PartNumber: R_470R_0402; Value: 470R
R78 = R_100k_0402: as R23 on sheet Display; PartNumber: R_100k_0402; Value: 100k
R79 R84 R93 R97 = R_10k_0402: as R40 on sheet NVME; PartNumber: R_10k_0402; Value: 10k
R80 = R_10k2_0402: as R51 on sheet POWER; Tolerance: 0.1%; Value: 10k2
R81 = R_909k_0402: RES, 909k, 0402; Manufacturer: Panasonic; PartSymbol: ERJ2RKF9093X; PartNumber: R_909k_0402; Value: 909k
R83 R92 = R_200k_0402: as R57 on sheet POWER; PartNumber: R_200k_0402; Value: 200k
R85 R94-R96 = R_2k_0402: as R28 on sheet Display; PartNumber: R_2k_0402; Value: 2k

## Sheet WIFI_BT.SchDoc
size A3
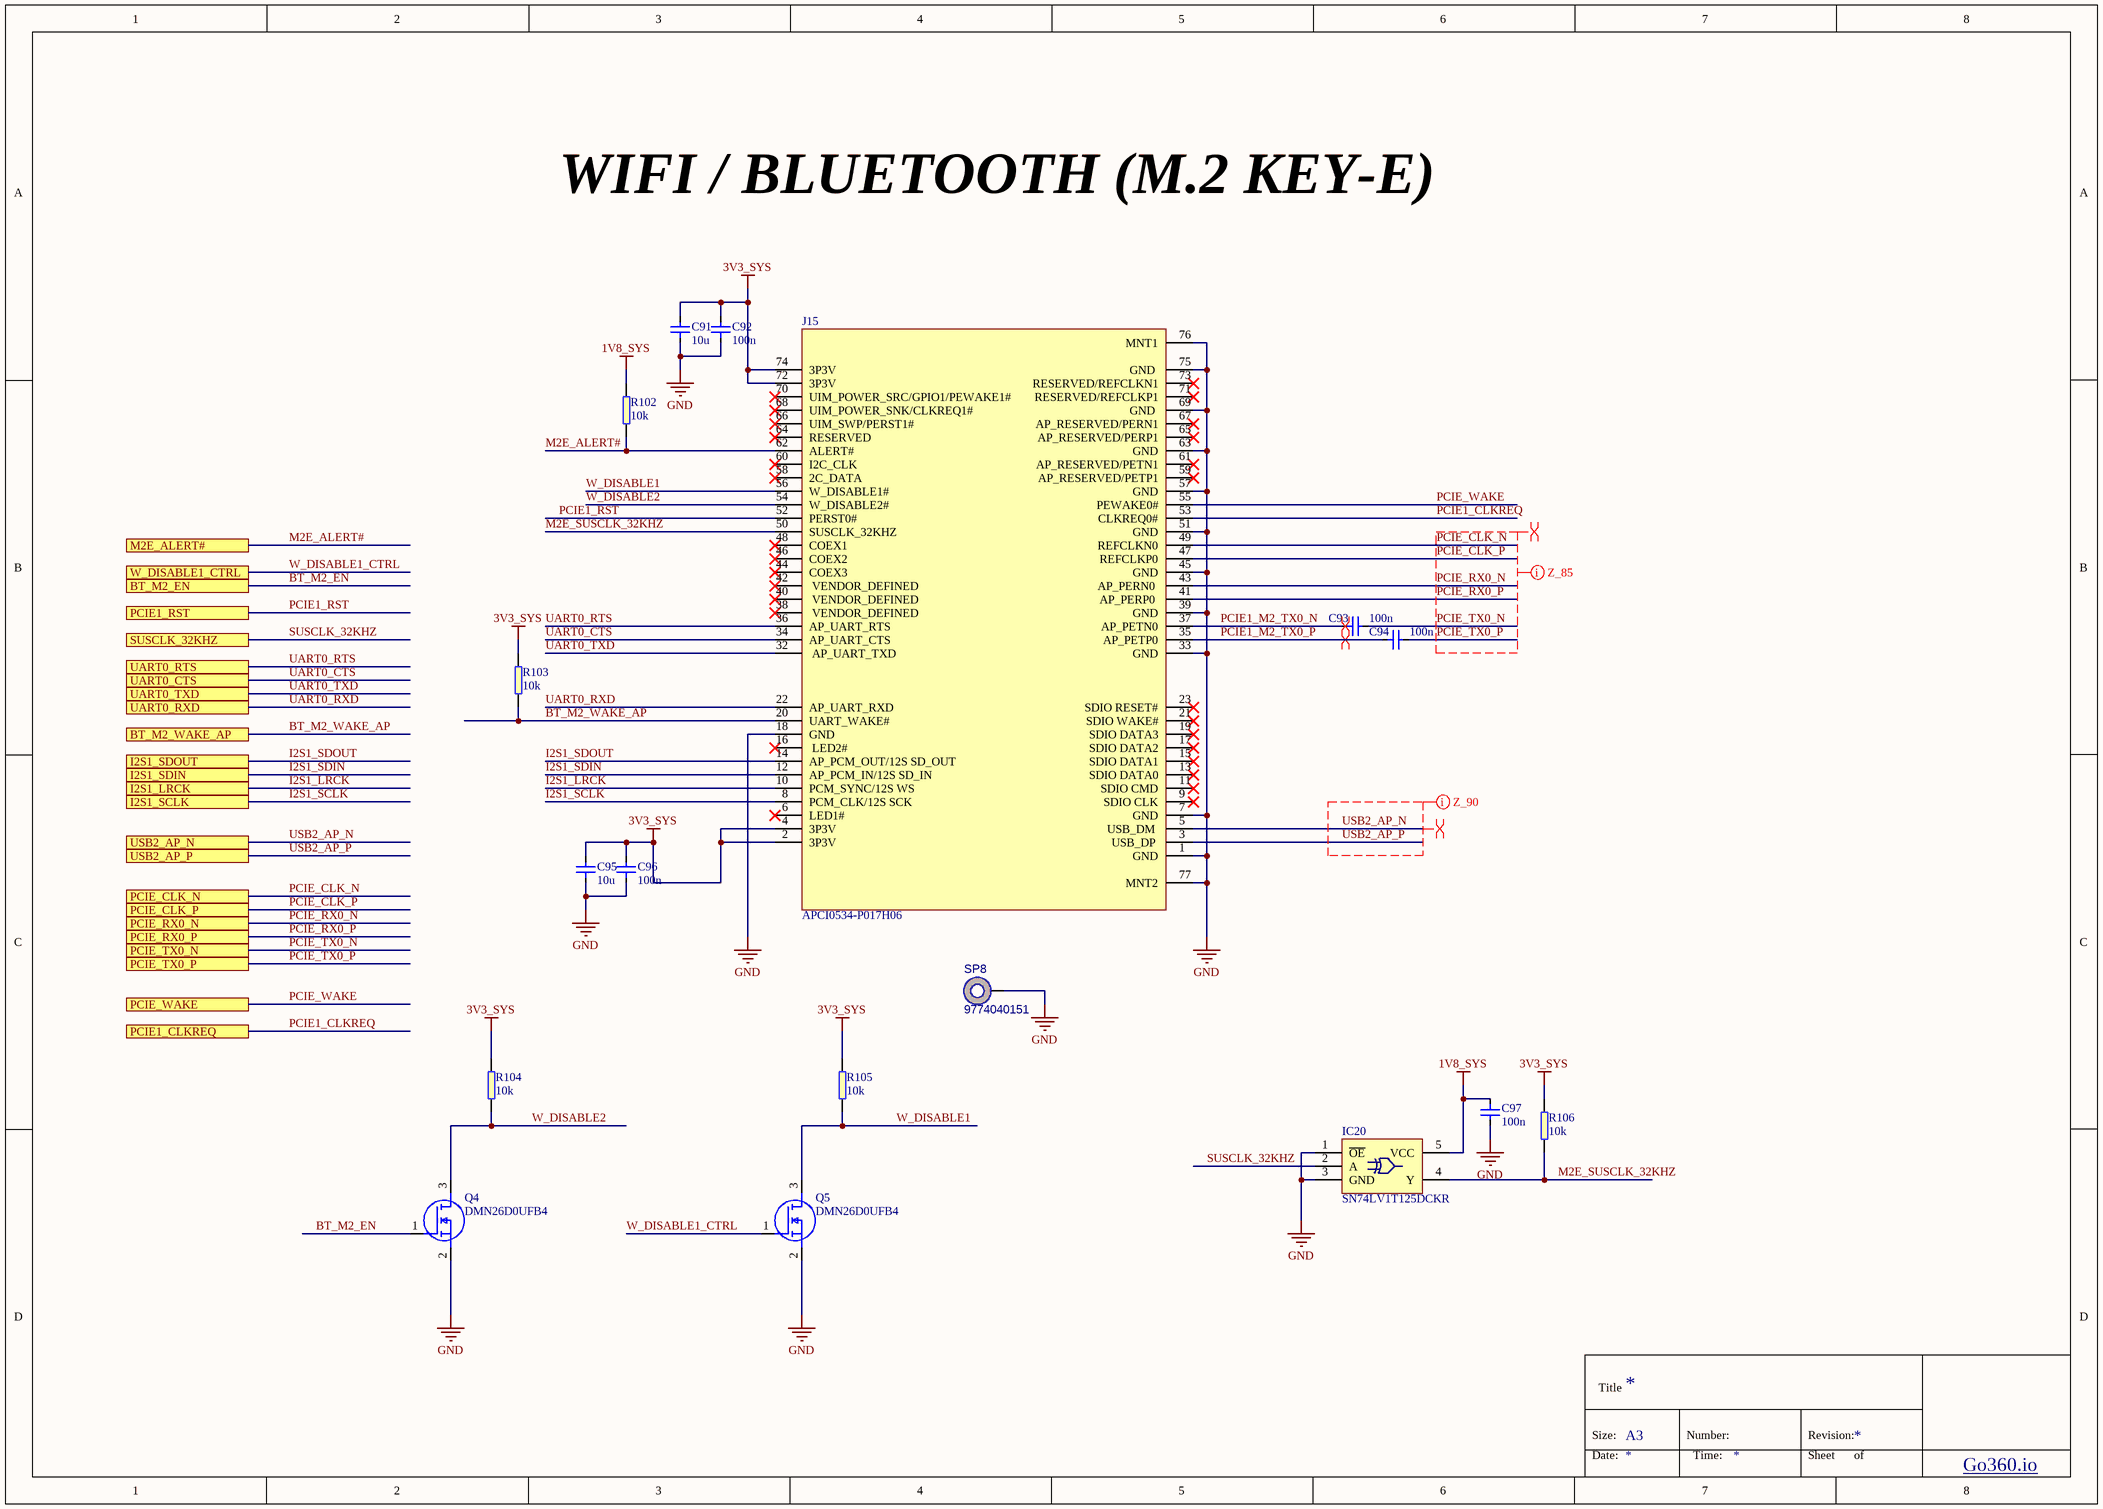
[diagram p6: WIFI_BT.SchDoc]

### Parts
C91  10u  [C0603]
C92  100n  [C0402]
C93  100n  [C0402]
C94  100n  [C0402]
C95  10u  [C0603]
C96  100n  [C0402]
C97  100n  [C0402]
IC20  SN74LV1T125DCKR  [SC70-5]
J15  APCI0534-P017H06  [CON_MINIPEX_067_SMT_RA_M2_KEYE_C]
Q4  DMN26D0UFB4  [DMN26D0UFB47]
Q5  DMN26D0UFB4  [DMN26D0UFB47]
R102  10k  [R0402]
R103  10k  [R0402]
R104  10k  [R0402]
R105  10k  [R0402]
R106  10k  [R0402]
SP8  9774040151  [MEC_STANDOFF_PTH_620C380P]

### Ports
BT_M2_EN, BT_M2_WAKE_AP, I2S1_LRCK, I2S1_SCLK, I2S1_SDIN, I2S1_SDOUT, M2E_ALERT#, PCIE1_CLKREQ, PCIE1_RST, PCIE_CLK_N, PCIE_CLK_P, PCIE_RX0_N, PCIE_RX0_P, PCIE_TX0_N, PCIE_TX0_P, PCIE_WAKE, SUSCLK_32KHZ, UART0_CTS, UART0_RTS, UART0_RXD, UART0_TXD, USB2_AP_N, USB2_AP_P, W_DISABLE1_CTRL

### Nets
1V8_SYS: C97.1 IC20.5(VCC) R102.2
3V3_SYS: C91.2 C92.2 C95.2 C96.2 J15.2(3P3V) J15.4(3P3V) J15.72(3P3V) J15.74(3P3V) R103.2 R104.2 R105.2 R106.2
GND: C91.1 C92.1 C95.1 C96.1 C97.2 IC20.1(~{OE}) IC20.3(GND) J15.1(GND) J15.7(GND) J15.18(GND) J15.33(GND) J15.39(GND) J15.45(GND) J15.51(GND) J15.57(GND) J15.63(GND) J15.69(GND) J15.75(GND) J15.76(MNT1) J15.77(MNT2) Q4.2(S) Q5.2(S) SP8.1
BT_M2_EN: Q4.1(G) ; port BT_M2_EN
BT_M2_WAKE_AP: J15.20(UART_WAKE#) R103.1 ; port BT_M2_WAKE_AP
I2S1_LRCK: J15.10(PCM_SYNC/12S_WS) ; port I2S1_LRCK
I2S1_SCLK: J15.8(PCM_CLK/12S_SCK) ; port I2S1_SCLK
I2S1_SDIN: J15.12(AP_PCM_IN/12S_SD_IN) ; port I2S1_SDIN
I2S1_SDOUT: J15.14(AP_PCM_OUT/12S_SD_OUT) ; port I2S1_SDOUT
M2E_ALERT#: J15.62(ALERT#) R102.1 ; port M2E_ALERT#
M2E_SUSCLK_32KHZ: IC20.4(Y) J15.50(SUSCLK_32KHZ) R106.1
PCIE1_CLKREQ: J15.53(CLKREQ0#) ; port PCIE1_CLKREQ
PCIE1_M2_TX0_N: C93.1 J15.37(AP_PETN0)
PCIE1_M2_TX0_P: C94.1 J15.35(AP_PETP0)
PCIE1_RST: J15.52(PERST0#) ; port PCIE1_RST
PCIE_CLK_N: J15.49(REFCLKN0) ; port PCIE_CLK_N
PCIE_CLK_P: J15.47(REFCLKP0) ; port PCIE_CLK_P
PCIE_RX0_N: J15.43(AP_PERN0) ; port PCIE_RX0_N
PCIE_RX0_P: J15.41(AP_PERP0) ; port PCIE_RX0_P
PCIE_TX0_N: C93.2 ; port PCIE_TX0_N
PCIE_TX0_P: C94.2 ; port PCIE_TX0_P
PCIE_WAKE: J15.55(PEWAKE0#) ; port PCIE_WAKE
SUSCLK_32KHZ: IC20.2(A) ; port SUSCLK_32KHZ
UART0_CTS: J15.34(AP_UART_CTS) ; port UART0_CTS
UART0_RTS: J15.36(AP_UART_RTS) ; port UART0_RTS
UART0_RXD: J15.22(AP_UART_RXD) ; port UART0_RXD
UART0_TXD: J15.32(AP_UART_TXD) ; port UART0_TXD
USB2_AP_N: J15.5(USB_DM) ; port USB2_AP_N
USB2_AP_P: J15.3(USB_DP) ; port USB2_AP_P
W_DISABLE1: J15.56(W_DISABLE1#) Q5.3(D) R105.1
W_DISABLE1_CTRL: Q5.1(G) ; port W_DISABLE1_CTRL
W_DISABLE2: J15.54(W_DISABLE2#) Q4.3(D) R104.1

Not connected (* = marked no-connect by the designer): J15 6(LED1#)* 9(_SDIO_CLK)* 11(SDIO_CMD)* 13(SDIO_DATA0)* 15(SDIO_DATA1)* 16(_LED2#)* 17(SDIO_DATA2)* 19(SDIO_DATA3)* 21(SDIO_WAKE#)* 23(SDIO_RESET#)* 38(_VENDOR_DEFINED)* 40(_VENDOR_DEFINED)* 42(_VENDOR_DEFINED)* 44(COEX3)* 46(COEX2)* 48(COEX1)* 58(2C_DATA)* 59(AP_RESERVED/PETP1)* 60(I2C_CLK)* 61(AP_RESERVED/PETN1)* 64(RESERVED)* 65(AP_RESERVED/PERP1)* 66(UIM_SWP/PERST1#)* 67(AP_RESERVED/PERN1)* 68(UIM_POWER_SNK/CLKREQ1#)* 70(UIM_POWER_SRC/GPIO1/PEWAKE1#)* 71(RESERVED/REFCLKP1)* 73(RESERVED/REFCLKN1)*

### Layout directives
mark named Z_85: PCIE_CLK_N, PCIE_CLK_P, PCIE_RX0_N, PCIE_RX0_P, PCIE_TX0_N, PCIE_TX0_P
differential pair: PCIE1_M2_TX0_N, PCIE1_M2_TX0_P, PCIE_CLK_N, PCIE_CLK_P, PCIE_RX0_N, PCIE_RX0_P, PCIE_TX0_N, PCIE_TX0_P, USB2_AP_N
net class Z_90: USB2_AP_N, USB2_AP_P

### Notes on the sheet
- WIFI / BLUETOOTH (M.2 KEY-E)
- Title
- Size:
- Date:
- A3
- Number:
- Time:
- Revision:
- Sheet
- of
- Go360.io

### Library data of the parts
C91 C95 = C_10u_0603: as C52 on sheet POWER; PartNumber: C_10u_0603; Value: 10u
C92-C94 C96 C97 = C_100n_0402: as C1 on sheet CSI; PartNumber: C_100n_0402; Value: 100n
IC20 = SN74LV1T125: Buffer, 74LV1T125, 1.6 V to 5.5 V, SOT-23-5; Manufacturer: Texas Instruments; PartNumber: SN74LV1T125DCKR; Value: SN74LV1T125DCKR; PartSymbol: SN74LV1T125DCKR
Q4 Q5 = DMN26D0UFB4: as Q1 on sheet POWER; Datasheet Link: https://componentsearchengine.com/Datasheets/1/DMN26D0UFB4-7.pdf; Height: 0.4mm; Arrow Part Number: DMN26D0UFB4-7; Arrow Price/Stock: https://www.arrow.com/en/products/dmn26d0ufb4-7/diodes-incorporated; Mouser Part Number: 621-DMN26D0UFB4-7; Mouser Price/Stock: https://www.mouser.co.uk/ProductDetail/Diodes-Incorporated/DMN26D0UFB4-7?qs=GWgl%252BsiMZr%252B4pznsTuF3iQ%3D%3D
R102-R106 = R_10k_0402: as R40 on sheet NVME; PartNumber: R_10k_0402; Value: 10k
SP8 = 9774040151: as SP1 on sheet NVME; PartNumber: 9774040151; Value: 9774040151; PartSymbol: 9774040151
J15 = APCI0534-P017H06: part number: APCI0534-P017H06

## Nets that join several sheets
1V8_SYS: Display (C32.1 IC4.5 R28.2), NVME (R40.2), POWER (5 pins), WIFI_BT (C97.1 IC20.5 R102.2)
3V3_CSI1: CSI (8 pins), POWER (C62.2 IC10.4 L6.2)
3V3_CSI2: CSI (8 pins), POWER (C65.2 IC11.4 L7.2)
3V3_CSI3: CSI (8 pins), POWER (C69.2 IC14.4 L8.2)
3V3_SYS: CSI (5 pins), Display (5 pins), ETHERNET (11 pins), NVME (14 pins), POWER (C49.2 C52.2 L4.2 R45.2), USB (5 pins), WIFI_BT (12 pins)
5V0_SYS: Display (IC5.13 IC5.15 L2.1), POWER (34 pins), USB (13 pins)
GND: CSI (66 pins), Display (40 pins), ETHERNET (16 pins), NVME (21 pins), POWER (45 pins), USB (31 pins), WIFI_BT (23 pins)
M2E_ALERT#: Display (M1#2.212), WIFI_BT (J15.62 R102.1)
OTG_USB_VBUS: Display (M1#2.87), USB (Q3.3)
PCIE_WAKE: NVME (J10.54), WIFI_BT (J15.55)
SUSCLK_32KHZ: Display (M1#2.210), WIFI_BT (IC20.2)
XVS: CSI (6 pins), Display (M1#2.206)